# EAGLE board star-tracker-card (EAGLE 9.6.1), part 1 of 3
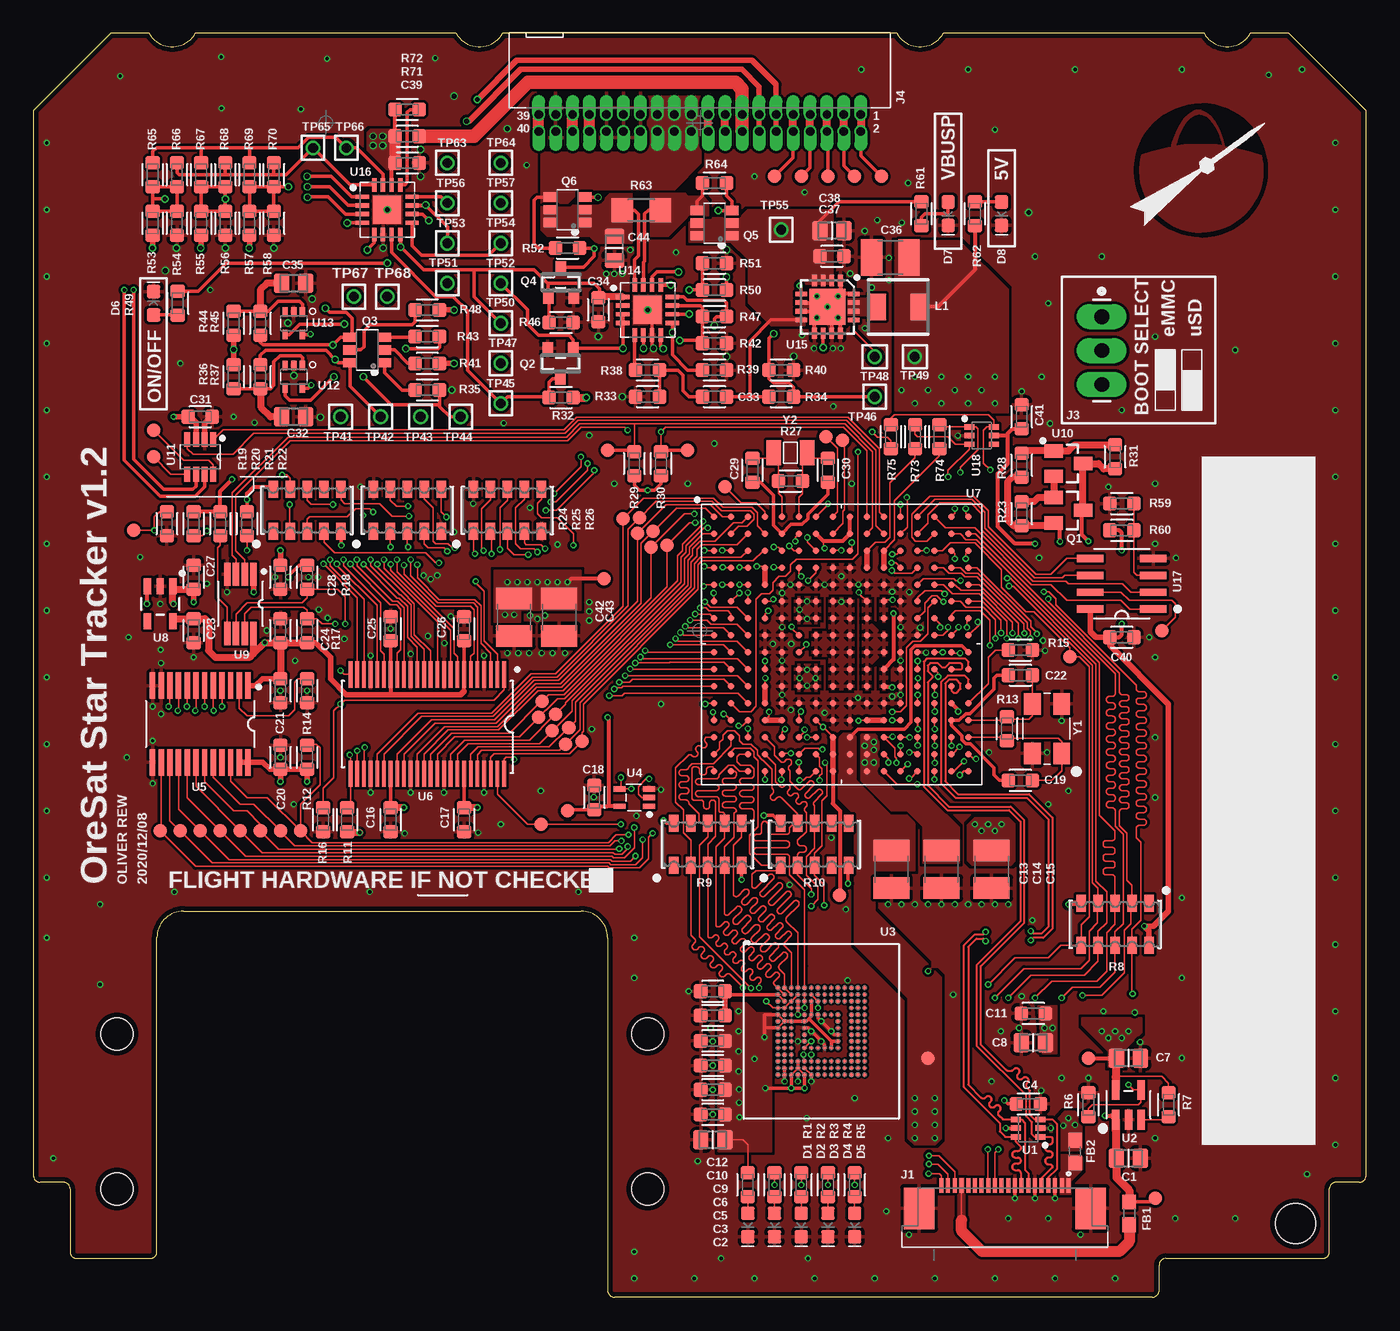
[diagram p9: board, top side]
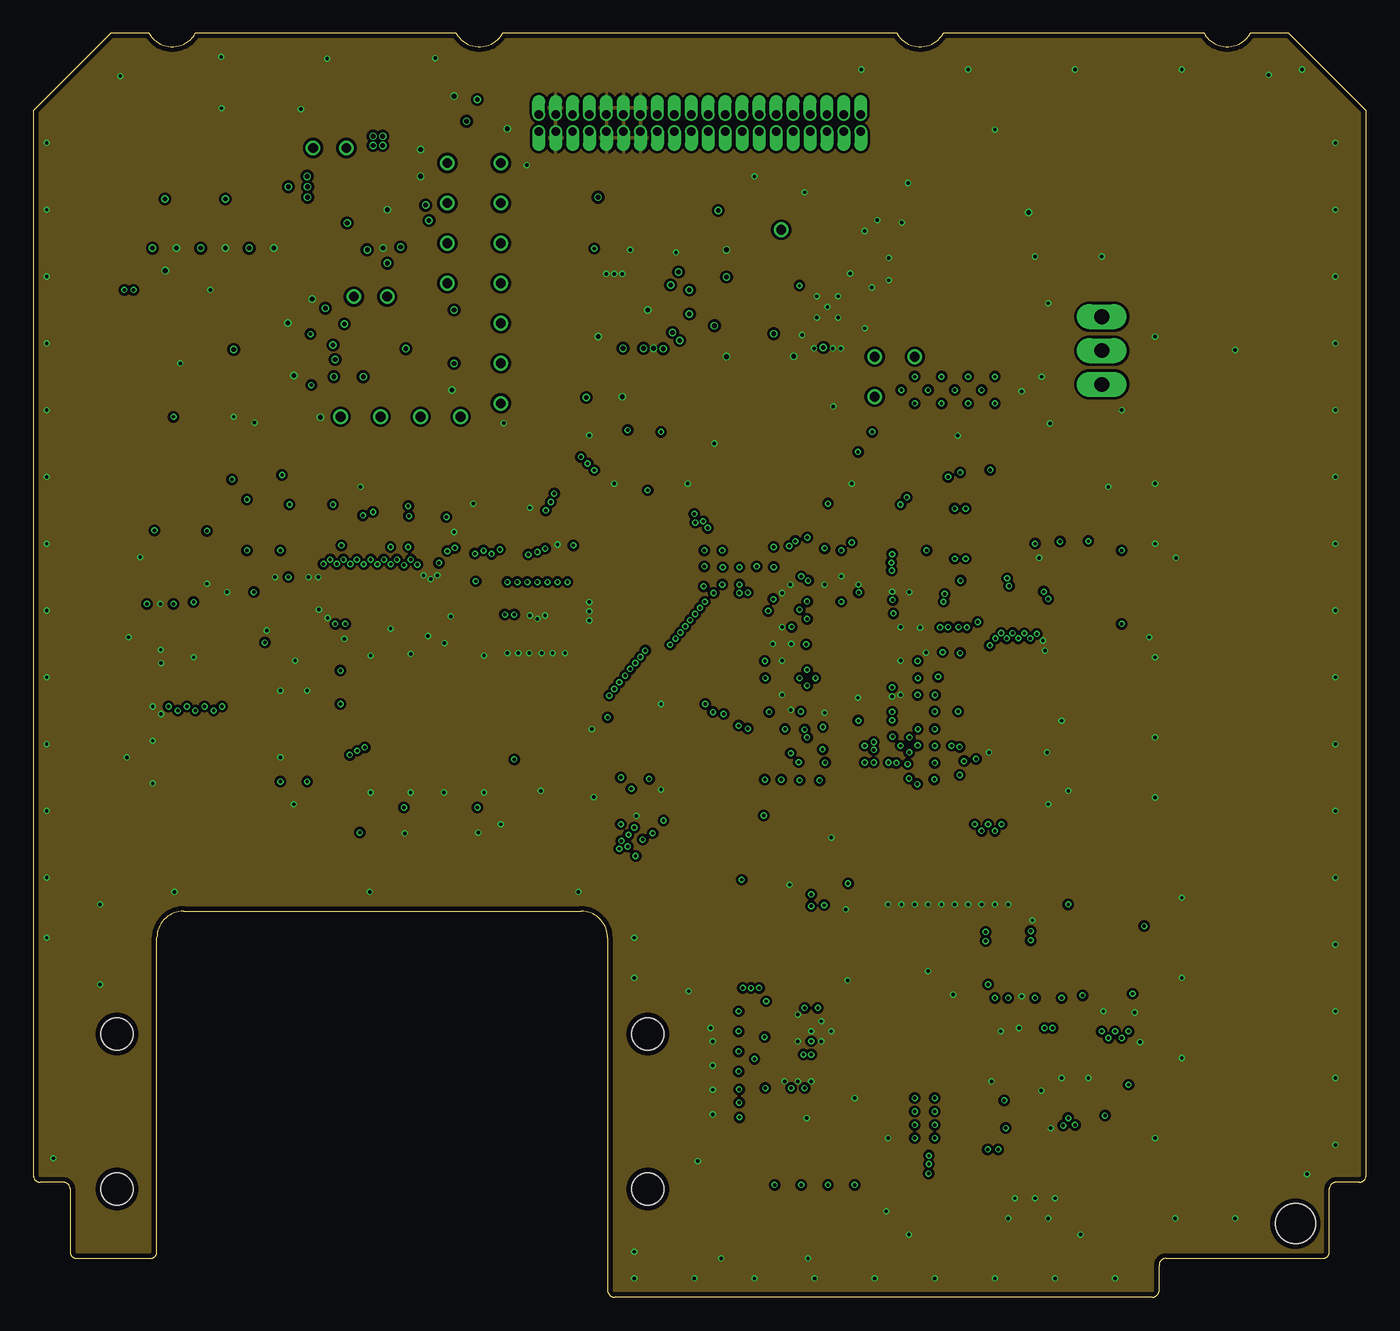
[diagram p10: board, inner layer Route2]
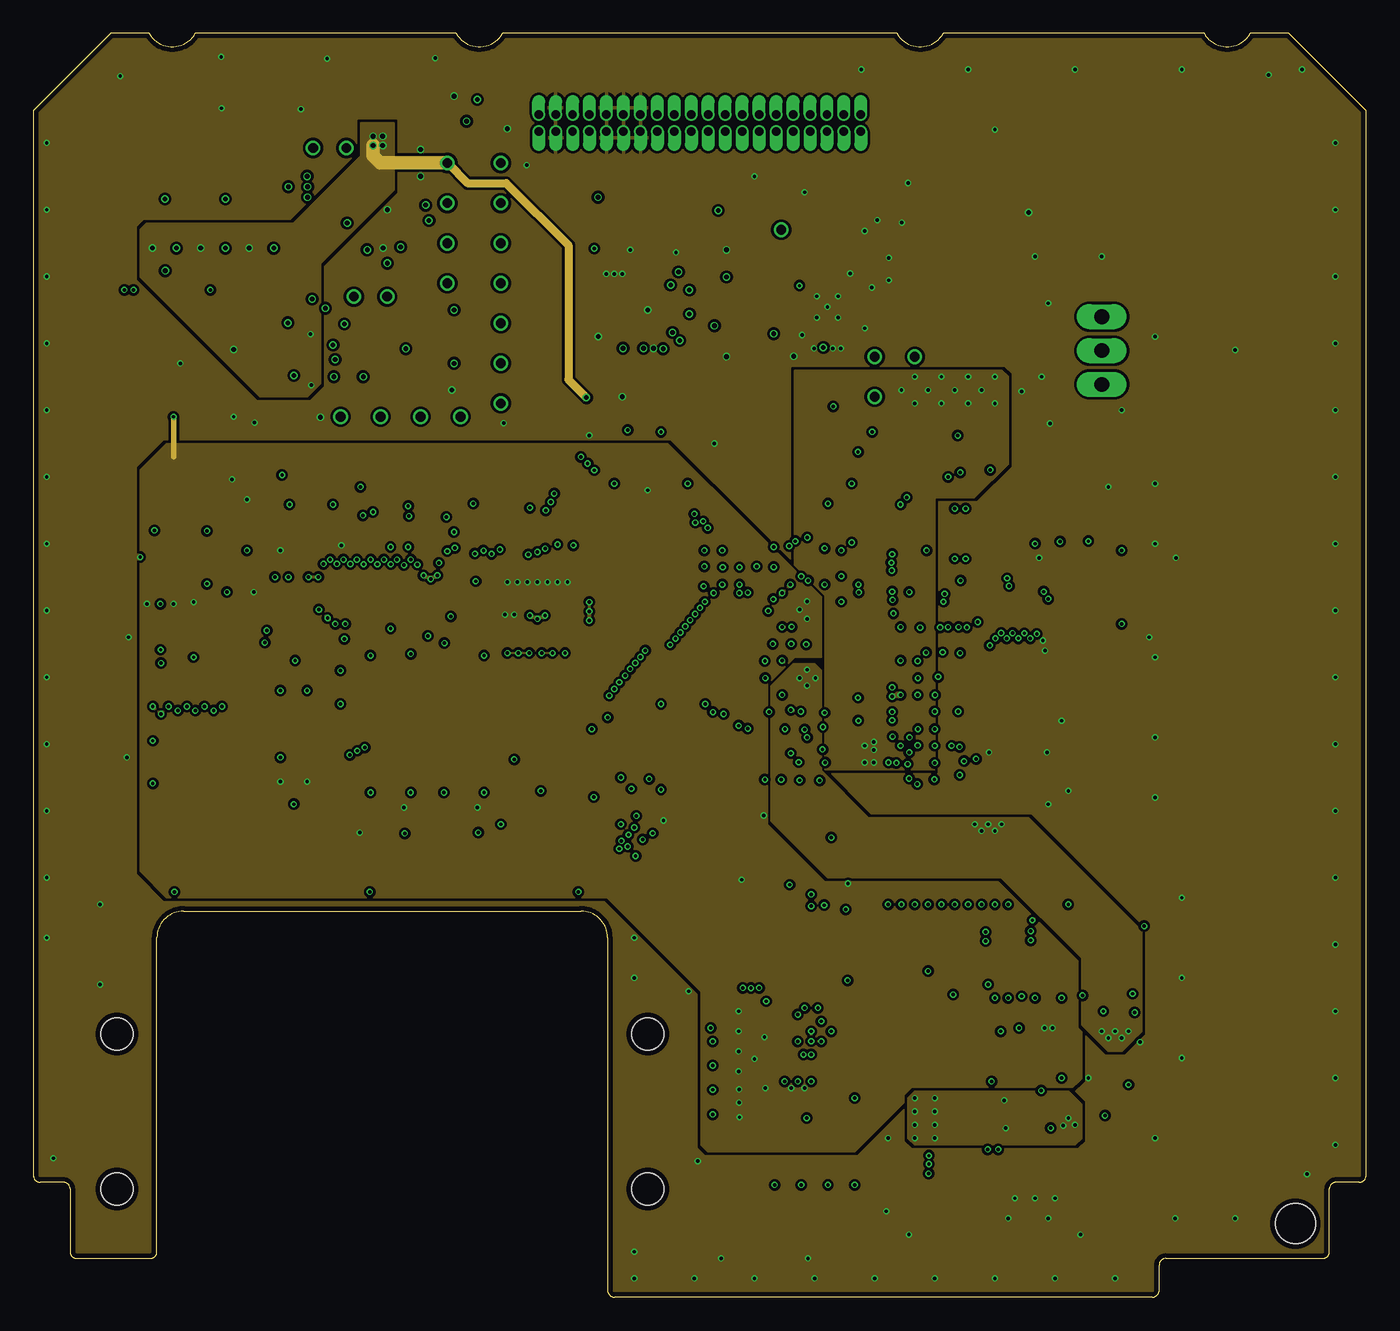
[diagram p11: board, inner layer Route15]
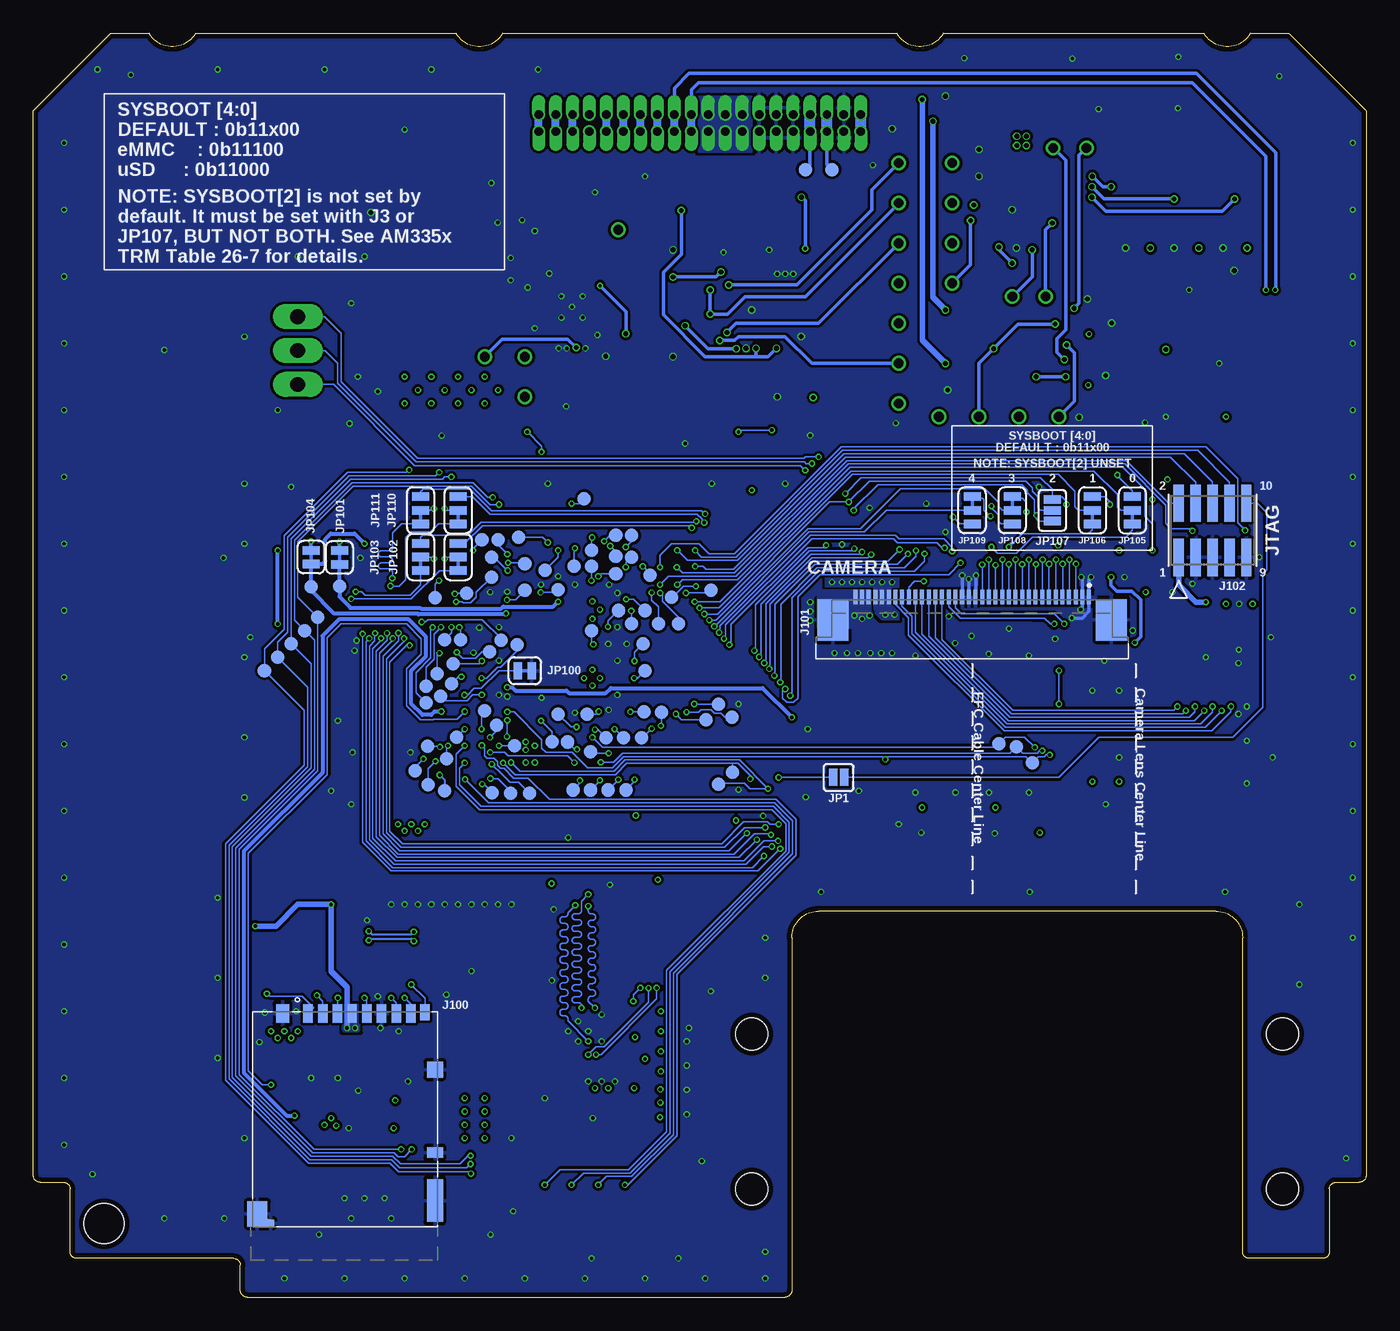
[diagram p12: board, bottom side, seen from below]

Size 99.8 x 94.6 mm. Coordinates in mm from the lower left corner, seen from the top.
Copper layers (1*2*15*16): Top 0.035559375mm / dielectric 0.17018125mm / Route2 0.01778125mm / dielectric 47mil / Route15 0.01778125mm / dielectric 0.17018125mm / Bottom 0.035559375mm
Design rules "4-layer_tented *": minimum track width 5mil, minimum drill 10mil, track to track 5mil, track to pad 5mil, pad to pad 5mil, via to via 5mil, smd to smd 5mil, copper to edge 15mil, drill to drill 6mil, minimum pad ring 4mil, minimum via ring 4mil, stop-mask expansion 2.5mil, vias tented up to drill 20mil, thermal gap 10mil
Net classes: 1 diff pair: width 0.191 mm, clearance 0.191 mm

## Footprints (pad centres in the part's own frame; a part is rotated, then mirrored left to right if it is on the bottom)
.0805-B = smd 1.15 x 1.45: 1 -0.9,0; 2 0.9,0
.0603-A = smd 1 x 1.05: 1 -0.9,0; 2 0.9,0
C1210 = smd 1.6 x 2.7: 1 -1.4,0; 2 1.4,0
.0805-B-NOSILK = smd 1.15 x 1.45: 1 -0.9,0; 2 0.9,0
LED-0603 = smd 1 x 1: A -0.877,0; C 0.877,0
0603 = smd 1.1 x 1: 1 -0.85,0; 2 0.85,0
TE_2-1734592-0 = smd 0.3 x 1.1: 1 -4.75,-1.7; 2 -4.25,-1.7; 3 -3.75,-1.7; 4 -3.25,-1.7; 5 -2.75,-1.7; 6 -2.25,-1.7; 7 -1.75,-1.7; 8 -1.25,-1.7; 9 -0.75,-1.7; 10 -0.25,-1.7; 11 0.25,-1.7; 12 0.75,-1.7; 13 1.25,-1.7; 14 1.75,-1.7; 15 2.25,-1.7; 16 2.75,-1.7; 17 3.25,-1.7; 18 3.75,-1.7; 19 4.25,-1.7; 20 4.75,-1.7 | smd 2.3 x 3.1: PAD1 6.42,0; PAD2 -6.42,0
1X03_LONGPADS = drill 1.118 pad 1.88 long: 1 0,0; 2 2.54,0; 3 5.08,0
J-SAMTEC-TFM-120-X1-XXX-D-RA = drill 0.635 pad 0.965 offset: 1 12.065,0.635; 2 12.065,-0.635; 3 10.795,0.635; 4 10.795,-0.635; 5 9.525,0.635; 6 9.525,-0.635; 7 8.255,0.635; 8 8.255,-0.635; 9 6.985,0.635; 10 6.985,-0.635; 11 5.715,0.635; 12 5.715,-0.635; 13 4.445,0.635; 14 4.445,-0.635; 15 3.175,0.635; 16 3.175,-0.635; 17 1.905,0.635; 18 1.905,-0.635; 19 0.635,0.635; 20 0.635,-0.635; 21 -0.635,0.635; 22 -0.635,-0.635; 23 -1.905,0.635; 24 -1.905,-0.635; 25 -3.175,0.635; 26 -3.175,-0.635; 27 -4.445,0.635; 28 -4.445,-0.635; 29 -5.715,0.635; 30 -5.715,-0.635; 31 -6.985,0.635; 32 -6.985,-0.635; 33 -8.255,0.635; 34 -8.255,-0.635; 35 -9.525,0.635; 36 -9.525,-0.635; 37 -10.795,0.635; 38 -10.795,-0.635; 39 -12.065,0.635; 40 -12.065,-0.635
DM3BT-DSF-PEJS = smd 0.7 x 1.4: 1 -3.2,15.95; 2 -2.1,15.95; 3 -1,15.95; 4 0.1,15.95; 5 1.2,15.95; 6 2.3,15.95; 7 3.4,15.95; 8 4.5,15.95 | smd 0.7 x 1.2: CD 5.55,16.05 | smd 0.5 x 0.5: CGND1 -6,0.25 | smd 1.5 x 1.9: CGND2 -7,0.95 | smd 0.21 x 0.21 rotated 45: CGND3 -6.25,0.5 | smd 1 x 1.4: CGND4 -5.1,15.95 | smd 1.2 x 1.2: CGND5 6.3,11.75 | smd 1.2 x 3.2: CGND6 6.3,1.95 | smd 1.2 x 0.8: GND 6.3,5.55
TE_3-1734592-6 = smd 0.3 x 1.1: 1 -8.75,0; 2 -8.25,0; 3 -7.75,0; 4 -7.25,0; 5 -6.75,0; 6 -6.25,0; 7 -5.75,0; 8 -5.25,0; 9 -4.75,0; 10 -4.25,0; 11 -3.75,0; 12 -3.25,0; 13 -2.75,0; 14 -2.25,0; 15 -1.75,0; 16 -1.25,0; 17 -0.75,0; 18 -0.25,0; 19 0.25,0; 20 0.75,0; 21 1.25,0; 22 1.75,0; 23 2.25,0; 24 2.75,0; 25 3.25,0; 26 3.75,0; 27 4.25,0; 28 4.75,0; 29 5.25,0; 30 5.75,0; 31 6.25,0; 32 6.75,0; 33 7.25,0; 34 7.75,0; 35 8.25,0; 36 8.75,0 | smd 2.3 x 3.1: S1 10.42,1.7; S2 -10.42,1.7
CON10_2X5_DUK_FTSH = smd 0.762 x 2.794: 1 -2.54,-2.032; 2 -2.54,2.032; 3 -1.27,-2.032; 4 -1.27,2.032; 5 0,-2.032; 6 0,2.032; 7 1.27,-2.032; 8 1.27,2.032; 9 2.54,-2.032; 10 2.54,2.032
SMT-JUMPER_2_NO_SILK = smd 0.635 x 1.27: 1 -0.406,0; 2 0.406,0
SMT-JUMPER_2_NC_TRACE_SILK = smd 0.635 x 1.27: 1 -0.508,0; 2 0.508,0
SMT-JUMPER_3_1-NC_TRACE_SILK = smd 0.635 x 1.27: 1 -1.016,0; 2 0,0; 3 1.016,0
SMT-JUMPER_3_NO_SILK = smd 0.635 x 1.27: 1 -0.813,0; 2 0,0; 3 0.813,0
ECS-MPI4040 = smd 2 x 1.3: 1 0,1.575; 2 0,-1.575
ORESAT-CARD-V1.3-STAR-TRACKER = hole 2.4: 46,19.7; 46,8.1; 6.25,19.7; 6.25,8.1 | hole 3: 94.5,5.5
SOT23-BEC = smd 1 x 1.4: B -0.95,-1.1; C 0,1.1; E 0.95,-1.1
SOT23 = smd 0.787 x 0.889: 1 -0.953,-1.143; 2 0.953,-1.143; 3 0,1.143
SOT23-6 = smd 0.7 x 1: 1 -0.95,-1.3; 2 0,-1.3; 3 0.95,-1.3; 4 0.95,1.3; 5 0,1.3; 6 -0.95,1.3
ARRAY_EXBA-M = smd 1.27 x 0.711: 1 -1.575,2.54; 2 -1.575,1.27; 3 -1.575,0; 4 -1.575,-1.27; 5 -1.575,-2.54; 6 1.575,-2.54; 7 1.575,-1.27; 8 1.575,0; 9 1.575,1.27; 10 1.575,2.54
R1206 = smd 1.6 x 1.803: 1 -1.422,0; 2 1.422,0
PAD.03X.04 = smd 1.016 x 1.016: P$1 0,0
2MM-TEST-POINT = drill 0.737: 1 0,0
SC70-6 = smd 0.4 x 0.75: 1 -0.65,-0.925; 2 0,-0.925; 3 0.65,-0.925; 4 0.65,0.925; 5 0,0.925; 6 -0.65,0.925
DBV5 = smd 1.473 x 0.559: 1 -1.118,0.95; 2 -1.118,0; 3 -1.118,-0.95; 4 1.118,-0.95; 5 1.118,0.95
BGA-153(11.5X13)(EMMC-BA) = smd 0.28 x 0.28: A1 -3.25,3.25; A2 -2.75,3.25; A3 -2.25,3.25; A4 -1.75,3.25; A5 -1.25,3.25; A6 -0.75,3.25; A7 -0.25,3.25; A8 0.25,3.25; A9 0.75,3.25; A10 1.25,3.25; A11 1.75,3.25; A12 2.25,3.25; A13 2.75,3.25; A14 3.25,3.25; B1 -3.25,2.75; B2 -2.75,2.75; B3 -2.25,2.75; B4 -1.75,2.75; B5 -1.25,2.75; B6 -0.75,2.75; B7 -0.25,2.75; B8 0.25,2.75; B9 0.75,2.75; B10 1.25,2.75; B11 1.75,2.75; B12 2.25,2.75; B13 2.75,2.75; B14 3.25,2.75; C1 -3.25,2.25; C2 -2.75,2.25; C3 -2.25,2.25; C4 -1.75,2.25; C5 -1.25,2.25; C6 -0.75,2.25; C7 -0.25,2.25; C8 0.25,2.25; C9 0.75,2.25; C10 1.25,2.25; C11 1.75,2.25; C12 2.25,2.25; C13 2.75,2.25; C14 3.25,2.25; D1 -3.25,1.75; D2 -2.75,1.75; D3 -2.25,1.75; D4 -1.75,1.75; D12 2.25,1.75; D13 2.75,1.75; D14 3.25,1.75; E1 -3.25,1.25; E2 -2.75,1.25; E3 -2.25,1.25; E5 -1.25,1.25; E6 -0.75,1.25; E7 -0.25,1.25; E8 0.25,1.25; E9 0.75,1.25; E10 1.25,1.25; E12 2.25,1.25; E13 2.75,1.25; E14 3.25,1.25; F1 -3.25,0.75; F2 -2.75,0.75; F3 -2.25,0.75; F5 -1.25,0.75; F10 1.25,0.75; F12 2.25,0.75; F13 2.75,0.75; F14 3.25,0.75; G1 -3.25,0.25; G2 -2.75,0.25; G3 -2.25,0.25; G5 -1.25,0.25; G10 1.25,0.25; G12 2.25,0.25; G13 2.75,0.25; G14 3.25,0.25; H1 -3.25,-0.25; H2 -2.75,-0.25; H3 -2.25,-0.25; H5 -1.25,-0.25; H10 1.25,-0.25; H12 2.25,-0.25; H13 2.75,-0.25; H14 3.25,-0.25; J1 -3.25,-0.75; J2 -2.75,-0.75; J3 -2.25,-0.75; J5 -1.25,-0.75; J10 1.25,-0.75; J12 2.25,-0.75; J13 2.75,-0.75; J14 3.25,-0.75; K1 -3.25,-1.25; K2 -2.75,-1.25; K3 -2.25,-1.25; K5 -1.25,-1.25; K6 -0.75,-1.25; K7 -0.25,-1.25; K8 0.25,-1.25; K9 0.75,-1.25; K10 1.25,-1.25; K12 2.25,-1.25; K13 2.75,-1.25; K14 3.25,-1.25; L1 -3.25,-1.75; L2 -2.75,-1.75; L3 -2.25,-1.75; L12 2.25,-1.75; L13 2.75,-1.75; L14 3.25,-1.75; M1 -3.25,-2.25; M2 -2.75,-2.25; M3 -2.25,-2.25; M4 -1.75,-2.25; M5 -1.25,-2.25; M6 -0.75,-2.25; M7 -0.25,-2.25; M8 0.25,-2.25; M9 0.75,-2.25; M10 1.25,-2.25; M11 1.75,-2.25; M12 2.25,-2.25; M13 2.75,-2.25; M14 3.25,-2.25; N1 -3.25,-2.75; N2 -2.75,-2.75; N3 -2.25,-2.75; N4 -1.75,-2.75; N5 -1.25,-2.75; N6 -0.75,-2.75; N7 -0.25,-2.75; N8 0.25,-2.75; N9 0.75,-2.75; N10 1.25,-2.75; N11 1.75,-2.75; N12 2.25,-2.75; N13 2.75,-2.75; N14 3.25,-2.75; P1 -3.25,-3.25; P2 -2.75,-3.25; P3 -2.25,-3.25; P4 -1.75,-3.25; P5 -1.25,-3.25; P6 -0.75,-3.25; P7 -0.25,-3.25; P8 0.25,-3.25; P9 0.75,-3.25; P10 1.25,-3.25; P11 1.75,-3.25; P12 2.25,-3.25; P13 2.75,-3.25; P14 3.25,-3.25
C70(TI-DCK) = smd 0.4 x 0.9: 1 0.65,1.1; 2 0,1.1; 3 -0.65,1.1; 4 -0.65,-1.1; 5 0.65,-1.1
PW24-M = smd 1.981 x 0.406: 1 -2.87,3.575; 2 -2.87,2.925; 3 -2.87,2.275; 4 -2.87,1.625; 5 -2.87,0.975; 6 -2.87,0.325; 7 -2.87,-0.325; 8 -2.87,-0.975; 9 -2.87,-1.625; 10 -2.87,-2.275; 11 -2.87,-2.925; 12 -2.87,-3.575; 13 2.87,-3.575; 14 2.87,-2.925; 15 2.87,-2.275; 16 2.87,-1.625; 17 2.87,-0.975; 18 2.87,-0.325; 19 2.87,0.325; 20 2.87,0.975; 21 2.87,1.625; 22 2.87,2.275; 23 2.87,2.925; 24 2.87,3.575
DGG48-M = smd 1.981 x 0.279: 1 -3.721,5.75; 2 -3.721,5.25; 3 -3.721,4.75; 4 -3.721,4.25; 5 -3.721,3.75; 6 -3.721,3.25; 7 -3.721,2.75; 8 -3.721,2.25; 9 -3.721,1.75; 10 -3.721,1.25; 11 -3.721,0.75; 12 -3.721,0.25; 13 -3.721,-0.25; 14 -3.721,-0.75; 15 -3.721,-1.25; 16 -3.721,-1.75; 17 -3.721,-2.25; 18 -3.721,-2.75; 19 -3.721,-3.25; 20 -3.721,-3.75; 21 -3.721,-4.25; 22 -3.721,-4.75; 23 -3.721,-5.25; 24 -3.721,-5.75; 25 3.721,-5.75; 26 3.721,-5.25; 27 3.721,-4.75; 28 3.721,-4.25; 29 3.721,-3.75; 30 3.721,-3.25; 31 3.721,-2.75; 32 3.721,-2.25; 33 3.721,-1.75; 34 3.721,-1.25; 35 3.721,-0.75; 36 3.721,-0.25; 37 3.721,0.25; 38 3.721,0.75; 39 3.721,1.25; 40 3.721,1.75; 41 3.721,2.25; 42 3.721,2.75; 43 3.721,3.25; 44 3.721,3.75; 45 3.721,4.25; 46 3.721,4.75; 47 3.721,5.25; 48 3.721,5.75
OSD335X-BGA-256 = smd 0.5 x 0.5: A1 -9.525,-9.525; A2 -9.525,-8.255; A3 -9.525,-6.985; A4 -9.525,-5.715; A5 -9.525,-4.445; A6 -9.525,-3.175; A7 -9.525,-1.905; A8 -9.525,-0.635; A9 -9.525,0.635; A10 -9.525,1.905; A11 -9.525,3.175; A12 -9.525,4.445; A13 -9.525,5.715; A14 -9.525,6.985; A15 -9.525,8.255; A16 -9.525,9.525; B1 -8.255,-9.525; B2 -8.255,-8.255; B3 -8.255,-6.985; B4 -8.255,-5.715; B5 -8.255,-4.445; B6 -8.255,-3.175; B7 -8.255,-1.905; B8 -8.255,-0.635; B9 -8.255,0.635; B10 -8.255,1.905; B11 -8.255,3.175; B12 -8.255,4.445; B13 -8.255,5.715; B14 -8.255,6.985; B15 -8.255,8.255; B16 -8.255,9.525; C1 -6.985,-9.525; C2 -6.985,-8.255; C3 -6.985,-6.985; C4 -6.985,-5.715; C5 -6.985,-4.445; C6 -6.985,-3.175; C7 -6.985,-1.905; C8 -6.985,-0.635; C9 -6.985,0.635; C10 -6.985,1.905; C11 -6.985,3.175; C12 -6.985,4.445; C13 -6.985,5.715; C14 -6.985,6.985; C15 -6.985,8.255; C16 -6.985,9.525; D1 -5.715,-9.525; D2 -5.715,-8.255; D3 -5.715,-6.985; D4 -5.715,-5.715; D5 -5.715,-4.445; D6 -5.715,-3.175; D7 -5.715,-1.905; D8 -5.715,-0.635; D9 -5.715,0.635; D10 -5.715,1.905; D11 -5.715,3.175; D12 -5.715,4.445; D13 -5.715,5.715; D14 -5.715,6.985; D15 -5.715,8.255; D16 -5.715,9.525; E1 -4.445,-9.525; E2 -4.445,-8.255; E3 -4.445,-6.985; E4 -4.445,-5.715; E5 -4.445,-4.445; E6 -4.445,-3.175; E7 -4.445,-1.905; E8 -4.445,-0.635; E9 -4.445,0.635; E10 -4.445,1.905; E11 -4.445,3.175; E12 -4.445,4.445; E13 -4.445,5.715; E14 -4.445,6.985; E15 -4.445,8.255; E16 -4.445,9.525; F1 -3.175,-9.525; F2 -3.175,-8.255; F3 -3.175,-6.985; F4 -3.175,-5.715; F5 -3.175,-4.445; F6 -3.175,-3.175; F7 -3.175,-1.905; F8 -3.175,-0.635; F9 -3.175,0.635; F10 -3.175,1.905; F11 -3.175,3.175; F12 -3.175,4.445; F13 -3.175,5.715; F14 -3.175,6.985; F15 -3.175,8.255; F16 -3.175,9.525; G1 -1.905,-9.525; G2 -1.905,-8.255; G3 -1.905,-6.985; G4 -1.905,-5.715; G5 -1.905,-4.445; G6 -1.905,-3.175; G7 -1.905,-1.905; G8 -1.905,-0.635; G9 -1.905,0.635; G10 -1.905,1.905; G11 -1.905,3.175; G12 -1.905,4.445; G13 -1.905,5.715; G14 -1.905,6.985; G15 -1.905,8.255; G16 -1.905,9.525; H1 -0.635,-9.525; H2 -0.635,-8.255; H3 -0.635,-6.985; H4 -0.635,-5.715; H5 -0.635,-4.445; H6 -0.635,-3.175; H7 -0.635,-1.905; H8 -0.635,-0.635; H9 -0.635,0.635; H10 -0.635,1.905; H11 -0.635,3.175; H12 -0.635,4.445; H13 -0.635,5.715; H14 -0.635,6.985; H15 -0.635,8.255; H16 -0.635,9.525; J1 0.635,-9.525; J2 0.635,-8.255; J3 0.635,-6.985; J4 0.635,-5.715; J5 0.635,-4.445; J6 0.635,-3.175; J7 0.635,-1.905; J8 0.635,-0.635; J9 0.635,0.635; J10 0.635,1.905; J11 0.635,3.175; J12 0.635,4.445; J13 0.635,5.715; J14 0.635,6.985; J15 0.635,8.255; J16 0.635,9.525; K1 1.905,-9.525; K2 1.905,-8.255; K3 1.905,-6.985; K4 1.905,-5.715; K5 1.905,-4.445; K6 1.905,-3.175; K7 1.905,-1.905; K8 1.905,-0.635; K9 1.905,0.635; K10 1.905,1.905; K11 1.905,3.175; K12 1.905,4.445; K13 1.905,5.715; K14 1.905,6.985; K15 1.905,8.255; K16 1.905,9.525; L1 3.175,-9.525; L2 3.175,-8.255; L3 3.175,-6.985; L4 3.175,-5.715; L5 3.175,-4.445; L6 3.175,-3.175; L7 3.175,-1.905; L8 3.175,-0.635; L9 3.175,0.635; L10 3.175,1.905; L11 3.175,3.175; L12 3.175,4.445; L13 3.175,5.715; L14 3.175,6.985; L15 3.175,8.255; L16 3.175,9.525; M1 4.445,-9.525; M2 4.445,-8.255; M3 4.445,-6.985; M4 4.445,-5.715; M5 4.445,-4.445; M6 4.445,-3.175; M7 4.445,-1.905; M8 4.445,-0.635; M9 4.445,0.635; M10 4.445,1.905; M11 4.445,3.175; M12 4.445,4.445; M13 4.445,5.715; M14 4.445,6.985; M15 4.445,8.255; M16 4.445,9.525; N1 5.715,-9.525; N2 5.715,-8.255; N3 5.715,-6.985; N4 5.715,-5.715; N5 5.715,-4.445; N6 5.715,-3.175; N7 5.715,-1.905; N8 5.715,-0.635; N9 5.715,0.635; N10 5.715,1.905; N11 5.715,3.175; N12 5.715,4.445; N13 5.715,5.715; N14 5.715,6.985; N15 5.715,8.255; N16 5.715,9.525; P1 6.985,-9.525; P2 6.985,-8.255; P3 6.985,-6.985; P4 6.985,-5.715; P5 6.985,-4.445; P6 6.985,-3.175; P7 6.985,-1.905; P8 6.985,-0.635; P9 6.985,0.635; P10 6.985,1.905; P11 6.985,3.175; P12 6.985,4.445; P13 6.985,5.715; P14 6.985,6.985; P15 6.985,8.255; P16 6.985,9.525; R1 8.255,-9.525; R2 8.255,-8.255; R3 8.255,-6.985; R4 8.255,-5.715; R5 8.255,-4.445; R6 8.255,-3.175; R7 8.255,-1.905; R8 8.255,-0.635; R9 8.255,0.635; R10 8.255,1.905; R11 8.255,3.175; R12 8.255,4.445; R13 8.255,5.715; R14 8.255,6.985; R15 8.255,8.255; R16 8.255,9.525; T1 9.525,-9.525; T2 9.525,-8.255; T3 9.525,-6.985; T4 9.525,-5.715; T5 9.525,-4.445; T6 9.525,-3.175; T7 9.525,-1.905; T8 9.525,-0.635; T9 9.525,0.635; T10 9.525,1.905; T11 9.525,3.175; T12 9.525,4.445; T13 9.525,5.715; T14 9.525,6.985; T15 9.525,8.255; T16 9.525,9.525
SOT23-5 = smd 0.55 x 1.2: 1 -0.95,-1.3; 2 0,-1.3; 3 0.95,-1.3; 4 0.95,1.3; 5 -0.95,1.3
DGK8-M = smd 1.727 x 0.483: 1 -2.223,0.975; 2 -2.223,0.325; 3 -2.223,-0.325; 4 -2.223,-0.975; 5 2.223,-0.975; 6 2.223,-0.325; 7 2.223,0.325; 8 2.223,0.975
SOT23-3 = smd 1 x 1.4: 1 -0.95,-1.1; 2 0.95,-1.1; 3 0,1.1
SOT23-8_TI-DCN = smd 0.45 x 1.1: 1 -0.975,-1.3; 2 -0.325,-1.3; 3 0.325,-1.3; 4 0.975,-1.3; 5 0.975,1.3; 6 0.325,1.3; 7 -0.325,1.3; 8 -0.975,1.3
SC70-5 = smd 0.4 x 0.7: 1 -0.65,-0.85; 2 0,-0.85; 3 0.65,-0.85; 4 0.65,0.85; 5 -0.65,0.85
QFN65P400X400X80-17T210 = smd 1.01 x 0.32: 1 -1.86,0.975; 2 -1.86,0.325; 3 -1.86,-0.325; 4 -1.86,-0.975; 9 1.86,-0.975; 10 1.86,-0.325; 11 1.86,0.325; 12 1.86,0.975 | smd 0.32 x 1.01: 5 -0.975,-1.86; 6 -0.325,-1.86; 7 0.325,-1.86; 8 0.975,-1.86; 13 0.975,1.86; 14 0.325,1.86; 15 -0.325,1.86; 16 -0.975,1.86 | smd 2.1 x 2.1: EPAD 0,0
S-PVQFN-16 = smd 0.85 x 0.35: 1 -1.975,0.975; 2 -1.975,0.325; 3 -1.975,-0.325; 4 -1.975,-0.975; 9 1.975,-0.975; 10 1.975,-0.325; 11 1.975,0.325; 12 1.975,0.975 | smd 0.35 x 0.85: 5 -0.975,-1.975; 6 -0.325,-1.975; 7 0.325,-1.975; 8 0.975,-1.975; 13 0.975,1.975; 14 0.325,1.975; 15 -0.325,1.975; 16 -0.975,1.975 | smd 2.7 x 2.7: PAD 0,0
SOIC8 = smd 1.981 x 0.559: 1 -2.362,1.905; 2 -2.362,0.635; 3 -2.362,-0.635; 4 -2.362,-1.905; 5 2.362,-1.905; 6 2.362,-0.635; 7 2.362,0.635; 8 2.362,1.905
5X3.2-4SMD = smd 1.6 x 1.25: 1 -1.85,-1.1; 2 1.85,-1.1; 3 1.85,1.1; 4 -1.85,1.1
CRYSTAL_3.2X1.5 = smd 1.1 x 1.9: P$1 -1.25,0; P$2 1.25,0

## Placement (x,y rotation side)
C1  10uF  [.0805-B]  82,10.4 0 top
C2  10uF  [.0805-B]  50.88,11.78 180 top
C3  1uF  [.0603-A]  50.88,13.68 180 top
C4  0.1uF  [.0603-A]  74.5,14.46 0 top
C5  1uF  [.0603-A]  50.88,15.53 180 top
C6  1uF  [.0603-A]  50.88,17.34 180 top
C7  10uF  [.0805-B]  82,17.9 0 top
C8  10uF  [.0805-B]  74.88,19.06 180 top
C9  1uF  [.0603-A]  50.88,19.18 180 top
C10  1uF  [.0603-A]  50.88,21.09 180 top
C11  0.1uF  [.0603-A]  74.88,21.24 180 top
C12  1uF  [.0603-A]  50.88,22.9 180 top
C13  22uF  [C1210]  64.25,32.02 270 top
C14  22uF  [C1210]  68,32.02 270 top
C15  22uF  [C1210]  71.75,32.02 270 top
C16  0.1uF  [.0603-A]  26.75,35.74 270 top
C17  0.1uF  [.0603-A]  32.25,35.74 270 top
C18  0.1uF  [.0603-A]  42,37.4 90 top
C19  18pF, 50V  [.0603-A]  73.91,38.68 0 top
C20  0.1uF  [.0603-A]  18.5,40.4 90 top
C21  0.1uF  [.0603-A]  18.5,45.4 270 top
C22  18pF, 50V  [.0603-A]  73.91,46.56 0 top
C23  1uF  [.0603-A]  12,49.9 270 top
C24  0.1uF  [.0603-A]  18.5,49.9 90 top
C25  0.1uF  [.0603-A]  26.75,50.02 90 top
C26  0.1uF  [.0603-A]  32.25,50.02 90 top
C27  1uF  [.0603-A]  12,53.9 90 top
C28  0.1uF  [.0603-A]  18.5,53.9 270 top
C29  18pF, 50V  [.0603-A]  53.84,61.9 270 top
C30  18pF, 50V  [.0603-A]  59.5,61.9 270 top
C31  0.1uF  [.0603-A]  12.5,65.9 180 top
C32  1uF  [.0805-B-NOSILK]  19.5,65.9 0 top
C33  1uF  [.0603-A]  51,67.4 0 top
C34  1uF  [.0603-A]  42.31,73.9 270 top
C35  1uF  [.0805-B-NOSILK]  19.5,75.9 0 top
C36  22uF  [C1210]  64.16,77.83 180 top
C37  1uF  [.0603-A]  59.8,77.91 0 top
C38  10uF  [.0805-B]  59.79,79.84 0 top
C39  0.1uF  [.0603-A]  28,84.9 180 top
C40  0.1uF  [.0603-A]  81.5,49.4 180 top
C41  0.1uF  [.0603-A]  74,65.9 90 top
C42  22uF  [C1210]  36,50.9 270 top
C43  22uF  [C1210]  39.38,50.9 270 top
C44  10uF  [.0805-B]  43.5,78.5 270 top
D1  GREEN  [LED-0603]  53.5,5.4 270 top
D2  BLUE  [LED-0603]  55.5,5.4 270 top
D3  BLUE  [LED-0603]  57.5,5.4 270 top
D4  BLUE  [LED-0603]  59.5,5.4 270 top
D5  BLUE  [LED-0603]  61.5,5.4 270 top
D6  AMBER  [LED-0603]  9,74.4 90 top
D7  GREEN  [LED-0603]  68.5,81.1 270 top
D8  GREEN  [LED-0603]  72.5,81.1 270 top
FB1  30Ω/1.8A  [0603]  82.06,6.28 270 top
FB2  30Ω/1.8A  [0603]  78,10.9 90 top
J1  ORESAT-DEBUG-CONNECTOR-CARD  [TE_2-1734592-0]  72.75,6.65 180 top
J3  [1X03_LONGPADS]  80,73.4 270 top
J4  TFM-120-01-L-D-RA  [J-SAMTEC-TFM-120-X1-XXX-D-RA]  49.9,87.9 0 top
J100  DM3BT-DSF-PEJS  [DM3BT-DSF-PEJS]  76.03,5.28 0 bottom
J101  3-1734592-64-1734592-0  [TE_3-1734592-6]  29.5,52.4 180 bottom
J102  FTSH-105-XX-X-DV-K  [CON10_2X5_DUK_FTSH]  11.5,57.4 0 bottom
JP1  JUMPER-SMT_2_NO_SILK  [SMT-JUMPER_2_NO_SILK]  39.5,38.9 0 bottom
JP100  JUMPER-SMT_2_NC_TRACE_SILK  [SMT-JUMPER_2_NC_TRACE_SILK]  63,46.9 0 bottom
JP101  JUMPER-SMT_2_NC_TRACE_SILK  [SMT-JUMPER_2_NC_TRACE_SILK]  76.88,55.37 90 bottom
JP102  JUMPER-SMT_3_1-NC_TRACE_SILK  [SMT-JUMPER_3_1-NC_TRACE_SILK]  68,55.4 270 bottom
JP103  JUMPER-SMT_3_1-NC_TRACE_SILK  [SMT-JUMPER_3_1-NC_TRACE_SILK]  70.81,55.4 270 bottom
JP104  JUMPER-SMT_2_NC_TRACE_SILK  [SMT-JUMPER_2_NC_TRACE_SILK]  79,55.4 90 bottom
JP105  JUMPER-SMT_3_1-NC_TRACE_SILK  [SMT-JUMPER_3_1-NC_TRACE_SILK]  17.5,58.9 270 bottom
JP106  JUMPER-SMT_3_1-NC_TRACE_SILK  [SMT-JUMPER_3_1-NC_TRACE_SILK]  20.5,58.9 270 bottom
JP107  JUMPER-SMT_3_NO_SILK  [SMT-JUMPER_3_NO_SILK]  23.5,58.9 270 bottom
JP108  JUMPER-SMT_3_1-NC_TRACE_SILK  [SMT-JUMPER_3_1-NC_TRACE_SILK]  26.5,58.9 90 bottom
JP109  JUMPER-SMT_3_1-NC_TRACE_SILK  [SMT-JUMPER_3_1-NC_TRACE_SILK]  29.5,58.9 90 bottom
JP110  JUMPER-SMT_3_1-NC_TRACE_SILK  [SMT-JUMPER_3_1-NC_TRACE_SILK]  68,58.9 270 bottom
JP111  JUMPER-SMT_3_1-NC_TRACE_SILK  [SMT-JUMPER_3_1-NC_TRACE_SILK]  70.81,58.9 270 bottom
L1  6.8u  [ECS-MPI4040]  64.76,74.12 90 top
PCB1  ORESAT-CARD-V1.3-STAR-TRACKER  [ORESAT-CARD-V1.3-STAR-TRACKER]  0,0 0 top
Q1  MMBT2907  [SOT23-BEC]  77.5,58.9 270 top
Q2  PMV45EN  [SOT23]  39.47,69.9 180 top
Q3  DMP2240UDM  [SOT23-6]  25,70.9 90 top
Q4  PMV45EN  [SOT23]  39.5,75.96 0 top
Q5  MOSFET-PCH-SOT23-6  [SOT23-6]  51,80.4 90 top
Q6  MOSFET-PCH-SOT23-6  [SOT23-6]  40,81.4 90 top
R1  1k  [.0603-A]  53.5,8.4 270 top
R2  1k  [.0603-A]  55.5,8.4 270 top
R3  1k  [.0603-A]  57.5,8.4 270 top
R4  1k  [.0603-A]  59.5,8.4 270 top
R5  1k  [.0603-A]  61.5,8.4 270 top
R6  10k  [.0603-A]  79,14.4 270 top
R7  10k  [.0603-A]  85,14.4 90 top
R8  10K  [ARRAY_EXBA-M]  81,27.9 270 top
R9  10K  [ARRAY_EXBA-M]  50.5,33.9 90 top
R10  10K  [ARRAY_EXBA-M]  58.5,33.9 90 top
R11  10k  [.0603-A]  23.5,35.74 270 top
R12  10k  [.0603-A]  20.5,40.4 270 top
R13  1M  [.0603-A]  72.91,42.56 270 top
R14  10k  [.0603-A]  20.5,45.4 270 top
R15  10k  [.0603-A]  73.91,48.43 180 top
R16  10k  [.0603-A]  21.69,35.74 270 top
R17  4.7k  [.0603-A]  20.5,49.9 90 top
R18  4.7k  [.0603-A]  20.5,53.9 270 top
R19  10k  [.0603-A]  10,57.9 90 top
R20  10k  [.0603-A]  12,57.9 90 top
R21  10k  [.0603-A]  14,57.9 90 top
R22  10k  [.0603-A]  16,57.9 90 top
R23  499  [.0603-A]  74,58.65 270 top
R24  100K  [ARRAY_EXBA-M]  20.5,58.9 90 top
R25  100K  [ARRAY_EXBA-M]  28,58.9 90 top
R26  100K  [ARRAY_EXBA-M]  35.5,58.9 90 top
R27  DNP  [.0603-A]  56.69,61.09 0 top
R28  10k  [.0603-A]  74,62.27 270 top
R29  4.7k  [.0603-A]  45,62.4 90 top
R30  4.7k  [.0603-A]  47,62.4 90 top
R31  40.2K  [.0603-A]  81,62.9 90 top
R32  10k  [.0603-A]  39.5,67.34 0 top
R33  100k  [.0603-A]  46,67.4 0 top
R34  10k  [.0603-A]  56,67.4 180 top
R35  665k  [.0603-A]  29.5,67.9 180 top
R36  1M  [.0603-A]  15,68.9 90 top
R37  330k  [.0603-A]  17,68.9 90 top
R38  10k  [.0603-A]  46,69.4 0 top
R39  10k  [.0603-A]  51,69.4 180 top
R40  NP  [.0603-A]  56,69.4 180 top
R41  100  [.0603-A]  29.5,69.9 180 top
R42  NP  [.0603-A]  51,71.4 180 top
R43  665k  [.0603-A]  29.5,71.9 180 top
R44  1M  [.0603-A]  15,72.9 270 top
R45  330k  [.0603-A]  17,72.9 270 top
R46  10k  [.0603-A]  39.5,72.96 180 top
R47  0  [.0603-A]  51,73.4 0 top
R48  100  [.0603-A]  29.5,73.9 180 top
R49  2.7k  [.0603-A]  10.81,74.4 90 top
R50  0  [.0603-A]  51,75.4 0 top
R51  NP  [.0603-A]  51,77.4 180 top
R52  10k  [.0603-A]  40,78.53 180 top
R53  NP  [.0603-A]  8.94,80.4 270 top
R54  NP  [.0603-A]  10.75,80.4 90 top
R55  NP  [.0603-A]  12.56,80.4 270 top
R56  NP  [.0603-A]  14.38,80.4 90 top
R57  NP  [.0603-A]  16.19,80.4 270 top
R58  NP  [.0603-A]  18,80.4 90 top
R59  DNP  [.0603-A]  81.5,59.4 180 top
R60  DNP  [.0603-A]  81.5,57.4 0 top
R61  2.7k  [.0603-A]  66.5,81.1 90 top
R62  2.7k  [.0603-A]  70.5,81.1 270 top
R63  100m  [R1206]  45.53,81.37 0 top
R64  10k  [.0603-A]  51,83.4 180 top
R65  NP  [.0603-A]  8.94,84.03 270 top
R66  NP  [.0603-A]  10.75,84.03 90 top
R67  NP  [.0603-A]  12.56,84.03 270 top
R68  NP  [.0603-A]  14.38,84.03 90 top
R69  NP  [.0603-A]  16.19,84.03 270 top
R70  NP  [.0603-A]  18,84.03 90 top
R71  100  [.0603-A]  28,86.9 180 top
R72  10k  [.0603-A]  28,88.9 180 top
R73  100  [.0603-A]  66.03,64.4 270 top
R74  100  [.0603-A]  67.84,64.4 270 top
R75  100  [.0603-A]  64.22,64.4 270 top
TP1  TEST-POINT3X4  [PAD.03X.04]  84,7.4 0 top
TP2  TEST-POINT3X4  [PAD.03X.04]  67,17.9 90 top
TP3  TEST-POINT3X4  [PAD.03X.04]  79,17.9 90 top
TP4  TEST-POINT3X4  [PAD.03X.04]  60.34,30.09 90 top
TP5  TEST-POINT3X4  [PAD.03X.04]  9.5,34.9 0 top
TP6  TEST-POINT3X4  [PAD.03X.04]  11,34.9 0 top
TP7  TEST-POINT3X4  [PAD.03X.04]  12.5,34.9 0 top
TP8  TEST-POINT3X4  [PAD.03X.04]  14,34.9 0 top
TP9  TEST-POINT3X4  [PAD.03X.04]  15.5,34.9 0 top
TP10  TEST-POINT3X4  [PAD.03X.04]  17,34.9 0 top
TP11  TEST-POINT3X4  [PAD.03X.04]  18.5,34.9 0 top
TP12  TEST-POINT3X4  [PAD.03X.04]  20,34.9 0 top
TP13  TEST-POINT3X4  [PAD.03X.04]  38,35.4 0 top
TP14  TEST-POINT3X4  [PAD.03X.04]  40,36.4 90 top
TP15  TEST-POINT3X4  [PAD.03X.04]  39.84,41.4 0 top
TP16  TEST-POINT3X4  [PAD.03X.04]  41.09,41.62 0 top
TP17  TEST-POINT3X4  [PAD.03X.04]  38.84,42.4 0 top
TP18  TEST-POINT3X4  [PAD.03X.04]  40.09,42.62 0 top
TP19  TEST-POINT3X4  [PAD.03X.04]  37.84,43.4 0 top
TP20  TEST-POINT3X4  [PAD.03X.04]  39.09,43.62 0 top
TP21  TEST-POINT3X4  [PAD.03X.04]  38.09,44.62 0 top
TP22  TEST-POINT3X4  [PAD.03X.04]  77.62,47.93 0 top
TP23  TEST-POINT3X4  [PAD.03X.04]  46.25,56.15 0 top
TP24  TEST-POINT3X4  [PAD.03X.04]  47.45,56.29 0 top
TP25  TEST-POINT3X4  [PAD.03X.04]  42.72,53.77 0 top
TP26  TEST-POINT3X4  [PAD.03X.04]  45.23,57.17 0 top
TP27  TEST-POINT3X4  [PAD.03X.04]  46.41,57.34 0 top
TP28  TEST-POINT3X4  [PAD.03X.04]  44.14,58.26 0 top
TP29  TEST-POINT3X4  [PAD.03X.04]  45.39,58.35 0 top
TP30  TEST-POINT3X4  [PAD.03X.04]  51.78,60.68 0 top
TP31  TEST-POINT3X4  [PAD.03X.04]  7.5,57.4 0 top
TP35  TEST-POINT3X4  [PAD.03X.04]  9,62.9 0 top
TP36  TEST-POINT3X4  [PAD.03X.04]  43,63.4 0 top
TP37  TEST-POINT3X4  [PAD.03X.04]  49,63.4 270 top
TP38  TEST-POINT3X4  [PAD.03X.04]  60.59,64.15 0 top
TP39  TEST-POINT3X4  [PAD.03X.04]  59.34,64.4 0 top
TP40  TEST-POINT3X4  [PAD.03X.04]  9,64.9 0 top
TP41  TEST-POINT  [2MM-TEST-POINT]  23,65.9 0 top
TP42  TEST-POINT  [2MM-TEST-POINT]  26,65.9 0 top
TP43  TEST-POINT  [2MM-TEST-POINT]  29,65.9 0 top
TP44  TEST-POINT  [2MM-TEST-POINT]  32,65.9 0 top
TP45  TEST-POINT  [2MM-TEST-POINT]  35,66.9 0 top
TP46  TEST-POINT  [2MM-TEST-POINT]  63,67.4 0 top
TP47  TEST-POINT  [2MM-TEST-POINT]  35,69.9 0 top
TP48  TEST-POINT  [2MM-TEST-POINT]  63,70.4 270 top
TP49  TEST-POINT  [2MM-TEST-POINT]  66,70.4 270 top
TP50  TEST-POINT  [2MM-TEST-POINT]  35,72.9 0 top
TP51  TEST-POINT  [2MM-TEST-POINT]  31,75.9 0 top
TP52  TEST-POINT  [2MM-TEST-POINT]  35,75.9 0 top
TP53  TEST-POINT  [2MM-TEST-POINT]  31,78.9 0 top
TP54  TEST-POINT  [2MM-TEST-POINT]  35,78.9 0 top
TP55  TEST-POINT  [2MM-TEST-POINT]  56,79.9 0 top
TP56  TEST-POINT  [2MM-TEST-POINT]  31,81.9 0 top
TP57  TEST-POINT  [2MM-TEST-POINT]  35,81.9 0 top
TP58  TEST-POINT3X4  [PAD.03X.04]  55.5,83.9 270 top
TP59  TEST-POINT3X4  [PAD.03X.04]  57.5,83.9 270 top
TP60  TEST-POINT3X4  [PAD.03X.04]  59.5,83.9 270 top
TP61  TEST-POINT3X4  [PAD.03X.04]  61.5,83.9 270 top
TP62  TEST-POINT3X4  [PAD.03X.04]  63.5,83.9 270 top
TP63  TEST-POINT  [2MM-TEST-POINT]  31,84.9 0 top
TP64  TEST-POINT  [2MM-TEST-POINT]  35,84.9 0 top
TP65  TEST-POINT  [2MM-TEST-POINT]  20.94,86.03 0 top
TP66  TEST-POINT  [2MM-TEST-POINT]  23.44,86.03 0 top
TP67  TEST-POINT  [2MM-TEST-POINT]  24,74.9 0 top
TP68  TEST-POINT  [2MM-TEST-POINT]  26.5,74.9 0 top
TP69  TEST-POINT3X4  [PAD.03X.04]  84.5,49.9 0 top
TP100  TEST-POINT3X4  [PAD.03X.04]  62.66,37.71 0 bottom
TP101  TEST-POINT3X4  [PAD.03X.04]  64.06,37.71 0 bottom
TP102  TEST-POINT3X4  [PAD.03X.04]  65.44,37.77 0 bottom
TP103  TEST-POINT3X4  [PAD.03X.04]  69,37.9 0 bottom
TP104  TEST-POINT3X4  [PAD.03X.04]  55.44,37.96 0 bottom
TP105  TEST-POINT3X4  [PAD.03X.04]  56.75,37.96 0 bottom
TP106  TEST-POINT3X4  [PAD.03X.04]  58.06,37.96 0 bottom
TP107  TEST-POINT3X4  [PAD.03X.04]  59.41,37.96 0 bottom
TP108  TEST-POINT3X4  [PAD.03X.04]  70.25,38.37 0 bottom
TP109  TEST-POINT3X4  [PAD.03X.04]  48.5,38.4 0 bottom
TP110  TEST-POINT3X4  [PAD.03X.04]  47.44,39.27 0 bottom
TP111  TEST-POINT3X4  [PAD.03X.04]  71.22,39.4 0 bottom
TP112  TEST-POINT3X4  [PAD.03X.04]  82.5,46.9 270 bottom
TP113  TEST-POINT3X4  [PAD.03X.04]  25,39.99 0 bottom
TP114  TEST-POINT3X4  [PAD.03X.04]  68.84,40.31 0 bottom
TP115  TEST-POINT3X4  [PAD.03X.04]  58.09,40.84 0 bottom
TP116  TEST-POINT3X4  [PAD.03X.04]  26.19,41.21 0 bottom
TP117  TEST-POINT3X4  [PAD.03X.04]  70.28,41.24 0 bottom
TP118  TEST-POINT3X4  [PAD.03X.04]  63.78,41.27 0 bottom
TP119  TEST-POINT3X4  [PAD.03X.04]  27.5,41.43 0 bottom
TP120  TEST-POINT3X4  [PAD.03X.04]  59.81,41.56 0 bottom
TP121  TEST-POINT3X4  [PAD.03X.04]  60.97,41.59 90 bottom
TP122  TEST-POINT3X4  [PAD.03X.04]  54.25,41.87 0 bottom
TP123  TEST-POINT3X4  [PAD.03X.04]  55.59,41.87 0 bottom
TP124  TEST-POINT3X4  [PAD.03X.04]  56.91,41.87 0 bottom
TP125  TEST-POINT3X4  [PAD.03X.04]  68.12,41.9 0 bottom
TP126  TEST-POINT3X4  [PAD.03X.04]  65.12,42.81 0 bottom
TP127  TEST-POINT3X4  [PAD.03X.04]  49.44,43.21 0 bottom
TP128  TEST-POINT3X4  [PAD.03X.04]  47.5,43.4 0 bottom
TP129  TEST-POINT3X4  [PAD.03X.04]  58.34,43.65 90 bottom
TP130  TEST-POINT3X4  [PAD.03X.04]  60.5,43.65 90 bottom
TP131  TEST-POINT3X4  [PAD.03X.04]  52.78,43.77 0 bottom
TP132  TEST-POINT3X4  [PAD.03X.04]  54.06,43.84 90 bottom
TP133  TEST-POINT3X4  [PAD.03X.04]  66,43.9 90 bottom
TP134  TEST-POINT3X4  [PAD.03X.04]  48.5,44.4 0 bottom
TP135  TEST-POINT3X4  [PAD.03X.04]  70.41,44.49 0 bottom
TP136  TEST-POINT3X4  [PAD.03X.04]  69.31,44.99 90 bottom
TP137  TEST-POINT3X4  [PAD.03X.04]  70.41,45.71 0 bottom
TP138  TEST-POINT3X4  [PAD.03X.04]  68.5,45.9 0 bottom
TP139  TEST-POINT3X4  [PAD.03X.04]  69.56,46.68 0 bottom
TP140  TEST-POINT3X4  [PAD.03X.04]  54,46.9 90 bottom
TP141  TEST-POINT3X4  [PAD.03X.04]  68.38,47.4 0 bottom
TP142  TEST-POINT3X4  [PAD.03X.04]  79.5,49.9 0 bottom
TP143  TEST-POINT3X4  [PAD.03X.04]  65.66,48.31 0 bottom
TP144  TEST-POINT3X4  [PAD.03X.04]  63.56,48.84 0 bottom
TP145  TEST-POINT3X4  [PAD.03X.04]  54.16,48.9 0 bottom
TP146  TEST-POINT3X4  [PAD.03X.04]  78.5,50.9 0 bottom
TP147  TEST-POINT3X4  [PAD.03X.04]  64.78,49.18 0 bottom
TP148  TEST-POINT3X4  [PAD.03X.04]  67.81,49.21 0 bottom
TP149  TEST-POINT3X4  [PAD.03X.04]  69,49.21 0 bottom
TP150  TEST-POINT3X4  [PAD.03X.04]  58,49.9 0 bottom
TP151  TEST-POINT3X4  [PAD.03X.04]  81.5,47.9 90 bottom
TP152  TEST-POINT3X4  [PAD.03X.04]  51.5,50.4 0 bottom
TP153  TEST-POINT3X4  [PAD.03X.04]  53,50.4 0 bottom
TP154  TEST-POINT3X4  [PAD.03X.04]  55,50.4 0 bottom
TP155  TEST-POINT3X4  [PAD.03X.04]  80.5,48.9 90 bottom
TP156  TEST-POINT3X4  [PAD.03X.04]  54,51.4 0 bottom
TP157  TEST-POINT3X4  [PAD.03X.04]  56,51.4 0 bottom
TP158  TEST-POINT3X4  [PAD.03X.04]  69.72,52.34 0 bottom
TP159  TEST-POINT3X4  [PAD.03X.04]  52,52.4 0 bottom
TP160  TEST-POINT3X4  [PAD.03X.04]  67.34,52.68 0 bottom
TP161  TEST-POINT3X4  [PAD.03X.04]  63,52.9 90 bottom
TP162  TEST-POINT3X4  [PAD.03X.04]  49.06,52.93 0 bottom
TP163  TEST-POINT3X4  [PAD.03X.04]  60.5,52.96 90 bottom
TP164  TEST-POINT3X4  [PAD.03X.04]  79,53.18 90 bottom
TP165  TEST-POINT3X4  [PAD.03X.04]  76.88,53.21 90 bottom
TP166  TEST-POINT3X4  [PAD.03X.04]  65.5,53.9 0 bottom
TP167  TEST-POINT3X4  [PAD.03X.04]  53.62,54.02 90 bottom
TP168  TEST-POINT3X4  [PAD.03X.04]  56.19,54.15 0 bottom
TP169  TEST-POINT3X4  [PAD.03X.04]  61.5,54.4 0 bottom
TP170  TEST-POINT3X4  [PAD.03X.04]  58,54.71 0 bottom
TP171  TEST-POINT3X4  [PAD.03X.04]  59.31,54.71 0 bottom
TP172  TEST-POINT3X4  [PAD.03X.04]  63,54.9 0 bottom
TP173  TEST-POINT3X4  [PAD.03X.04]  55,55.4 0 bottom
TP174  TEST-POINT3X4  [PAD.03X.04]  65.5,55.4 0 bottom
TP175  TEST-POINT3X4  [PAD.03X.04]  56.19,55.46 0 bottom
TP176  TEST-POINT3X4  [PAD.03X.04]  58,55.9 0 bottom
TP177  TEST-POINT3X4  [PAD.03X.04]  65,56.68 0 bottom
TP178  TEST-POINT3X4  [PAD.03X.04]  66.22,56.68 0 bottom
TP179  TEST-POINT3X4  [PAD.03X.04]  63.47,56.87 0 bottom
TP180  TEST-POINT3X4  [PAD.03X.04]  55,57.02 0 bottom
TP181  TEST-POINT3X4  [PAD.03X.04]  56.19,57.02 0 bottom
TP182  TEST-POINT3X4  [PAD.03X.04]  58.56,59.77 0 bottom
TP183  TEST-POINT3X4  [PAD.03X.04]  40,84.4 0 bottom
TP184  TEST-POINT3X4  [PAD.03X.04]  42,84.4 0 bottom
U1  RCLAMP0504FB  [SC70-6]  74.5,12.65 90 top
U2  TPS2051CDBVR  [DBV5]  82,14.4 90 top
U3  THGBMJG7C2LBAU8  [BGA-153(11.5X13)(EMMC-BA)]  59,19.9 0 top
U4  SN74LVC1G07DCK  [C70(TI-DCK)]  45,37.4 270 top
U5  SN74LVC8T245MPWREPPW24-M  [PW24-M]  12.5,42.9 270 top
U6  CLVCH16T245MDGGREP  [DGG48-M]  29.5,42.9 270 top
U7  OSD3358-512M-BSM  [OSD335X-BGA-256]  60.5,48.9 270 top
U8  TLV70028QDDCRQ1  [SOT23-5]  9.5,51.9 180 top
U9  TCA9509DGKRDGK8-M  [DGK8-M]  15.5,51.9 270 top
U10  TLVH431  [SOT23-3]  77.5,62.4 270 top
U11  TCAN330  [SOT23-8_TI-DCN]  12.5,62.9 180 top
U12  MIC842LYC5  [SC70-5]  19.5,68.9 180 top
U13  MIC842LYC5  [SC70-5]  19.5,72.9 180 top
U14  MAX4211FETE  [QFN65P400X400X80-17T210]  46,73.9 0 top
U15  TPS62112  [S-PVQFN-16]  59.46,74.12 270 top
U16  MAX7310ATE  [QFN65P400X400X80-17T210]  26.5,81.4 0 top
U17  25AAXX  [SOIC8]  81.5,53.4 180 top
U18  RCLAMP0504FB  [SC70-6]  71,64.49 270 top
U$1  FLIGHMARKERNEW  [FLIGHTMARKER_NEW_BOARDS]  10.1,30.6 0 top
U$2  [CAMERA_BOARD_TOP_DIMS]  10.25,21.1 0 top
U$3  [PSAS_LOGO_10X10]  87.5,84.4 0 top
Y1  24MHz  [5X3.2-4SMD]  75.91,42.56 90 top
Y2  ABS07-32.768KHZ-T  [CRYSTAL_3.2X1.5]  56.69,63.21 0 top

## Tracks (layer width: path | path; a pad name or v marks a point on that pad's centre or on a via)
2.8V  (via drill 0.25)
  Top 0.254: C25.1 U6.18 | U6.7 C26.1 | R18.1 19.9,54.8 19.1,54 v19.1,53.9
  Top 0.305: 32.25,45.34 U6.7 | U6.18 26.75,45.09
  Top 0.406: U5.1 16.62,45.77 17.15,46.3 C21.1 | 32.25,45.34 32,45.09 26.75,45.09 23.44,45.09 22.25,46.27 22.25,47.9 21.15,49 R17.1
  Top 0.508: U8.5 10.65,50.8 C23.1 12.85,50.8 13.12,50.52 13.12,48.4 13.62,47.9 16.19,47.9 16.48,48.18 | U9.8 16.48,48.18 | 16.48,48.18 16.48,48.15 v17.32,49 C24.1 | C24.1 R17.1 | C24.1 C21.1
  Bottom 0.254: v19.1,53.9 19.1,53.27 18.66,52.84 17.54,52.84 16.89,52.19 16.89,49.44 v17.32,49
3.3V  (via drill 0.25)
  Top 0.127: R1.1 53.5,11.4 53.12,11.78 C2.1
  Top 0.152: 55.75,21.15 56.25,20.65 55.75,20.15 | U3.P5 U3.N4 U3.P3
  Top 0.254: U3.C6 U3.E6 58.25,21.02 58.06,20.84 | 58.06,20.84 57.88,20.65 U3.F5 56.25,20.65 | 55.75,21.15 54.75,21.15 v54.75,19.46 54.75,20.15 55.75,20.15 | U3.K9 59.75,19.15 | U3.J10 59.75,19.15 | 59.75,19.15 58.06,20.84 | U3.M4 U3.N4 | U3.P3 v56.75,15.65 | U3.P5 v57.75,15.65 v56.75,15.65 | U6.42 32.25,36.9 C17.1 | U6.31 C16.1 | R9.10 47.39,35.48 v47.19,35.68 | R9.5 53.04,31.25 v53.03,31.24 | v54.69,36.06 55.38,36.06 R10.10 | R10.5 61,32.28 v61,30.96 | v54.81,15.65 v56.75,15.65 | R24.5 23.04,56.3 v23.06,56.27 | R29.1 45,60.77 45.38,60.4 v46,60.4 46.5,60.4 47,60.9 R30.1 | R22.2 v16,59.71
  Top 0.305: R20.2 R21.2 14,60.34 v14.88,61.21 | U8.3 8.5,53.15 v8.5,51.9 | v16,59.71 16,60.15 16.5,60.65 17.79,60.65 R24.10 | C40.2 81.31,49.4 81.5,49.59 v81.5,50.4 | v81.5,55.9 81.5,57.21 81.31,57.4 R60.1 | TP25.P$1 40.25,53.77 v40,53.52
  Top 0.406: v77.5,29.4 77.58,29.48 R8.5 | R8.10 83.54,27.42 v83.19,27.77 83.88,27.77 85,28.9 85,44.4 80.6,48.8 C40.2 79.56,49.4 79.14,49.83 U17.8 | U5.23 U5.24 17.18,40.03 17.71,39.5 C20.1 | C20.1 R12.2 v20.5,38.59 | v16.51,52.77 v16.5,52.78 16.5,54.1 U9.1 | C27.1 v12,52.02 | C20.1 v18.5,38.59 | C28.1 v18.5,55.9 | U11.3 12.18,65.47 11.75,65.9 C31.2 v10.5,65.9
  Top 0.508: v24.44,34.77 23.57,34.77 R11.2 | v27.75,36.65 C16.1 | v33.25,36.65 32.5,36.65 32.25,36.9 | v10.5,51.9 10.45,51.95 U8.1 10.65,53 C27.1
  Route15 0.406: v10.5,65.9 10.5,62.9
  Bottom 0.305: v81.5,50.4 v81.5,55.9
  Bottom 0.406: v76.31,20.15 76.31,23.21 77.5,24.4 v77.5,29.4 80,29.4 81.62,27.77 v83.19,27.77 | J102.1 14.04,53.31 12.75,52.02 v12,52.02
  other vias: 52.88,13.46 52.81,16.9 52.81,18.4 52.81,19.9 52.81,21.4 54,17.84 57.38,51.46 57.94,52.09 57.94,50.77 52.84,15.56 52.84,14.56 75.72,20.15 35.5,53.52 36.25,53.52 37,53.52 37.75,53.52 38.5,53.52 39.25,53.52 36,51.09 35.31,51.09
  pour Top (isolate 0.2, no thermals): 51.31,22.02 53.38,22.02 54.12,21.27 55.25,21.27 55.25,10.9 51.31,10.9
  pour Top: 57,52.21 57,50.65 57.19,50.46 58.75,50.46 58.94,50.65 58.94,52.21 58.75,52.4 57.19,52.4
  pour Route15 (isolate 0.2): 59,52.4 59,47.9 57,47.9 54.97,45.87 54.97,32.87 53,30.9 49,30.9 48,31.9 48,58.4 49,59.4 52,59.4
  pour Bottom (no thermals): 75.47,21.93 75.47,20.46 75.38,20.37 75.38,19.99 75.5,19.87 76.53,19.87 76.66,19.99 76.66,20.34 76.53,20.46 76.53,21.93
  pour Top (no thermals): 75.22,21.81 75.56,18.21 76.66,18.21 76.66,21.81
  pour Route15 (isolate 0.2, no thermals): 54,57.4 47.5,63.9 10,63.9 8,61.9 8,31.9 10,29.9 52,29.9 54,31.9
  pour Route15 (isolate 0.2, rank 5): 43,37.9 53,37.9 59.5,31.4 72.5,31.4 78.5,25.4 78.5,16.4 77.5,15.4 66,15.4 61.5,10.9 50.5,10.9 50,11.4 50,22.9 43,29.9
  pour Top (no thermals): 34.5,54.4 41,54.4 41,51.4 36.5,51.4 36.5,50.52 34.5,50.52
  pour Bottom (rank 2, no thermals): 35,54.4 40.5,54.4 40.5,52.9 37.5,52.9 37.5,51.96 36.25,50.71 35,50.71
3.3VA  (via drill 0.25)
  Top 0.254: 43.06,36.75 43,36.75 | 42,36.75 C18.1 40,36.5 TP14.P$1
  Top 0.305: v64.4,51.18 64.42,51.17 64.42,47.74 U7.K11 | v64.31,45.65 63.75,45.65 U7.L11 | U4.5 43.06,36.75 43.06,43.34 v43,43.4 | 42,36.75 43,36.75 | v75,56.4 73.5,56.4 72.22,57.68 72.22,61.65 72.97,62.4 72.97,64.49 | 72.97,64.49 U18.5 | 72.97,64.49 72.97,64.65 73.32,65 C41.1
  Bottom 0.305: v64.31,45.65 63.94,45.65 63.69,45.4 59.88,45.4 59.69,45.21 56.94,45.21 56.55,45.6 45.2,45.6 v43,43.4 | v64.4,51.18 64.48,51.1 70.96,51.1 71.02,51.17 77.27,51.17 79,52.9 TP164.P$1 JP104.1 78.13,54.89 77.94,55.09 77.94,56.74 77.53,57.15 75.75,57.15 v75,56.4
  pour Top: 63.81,47.27 63.53,47.27 63.38,47.12 63.38,45.59 63.53,45.43 63.81,45.43 63.97,45.59 63.97,47.12
5V  (via drill 0.25, 0.35)
  Top 0.254: U15.10 59.14,71.11 v59.16,71.09
  Top 0.3: R62.2 70.5,76.9 67.72,74.12 L1.2
  Bottom 0.254: v59.16,71.09 59.78,71.71 64.69,71.71 TP49.1
  other vias: 62.25,40.02 62.94,40.02 62.25,41.27 62.94,41.56 62.94,40.96 72,68.9 71,67.9 72,66.9 70,66.9 70,68.9 69,67.9 68,68.9 68,66.9 67,67.9 66,68.9 66,66.9 65,67.9
  pour Top (isolate 0.2, no thermals): 64.5,79.09 69.31,79.09 73,75.4 73,66.21 64.5,66.21
  pour Top (isolate 0.2, no thermals): 62.94,42.21 62.12,42.21 61.97,42.06 61.97,38.68 64.25,36.4 65.47,36.4 66.62,35.24 66.62,32.49 69.34,32.49 69.34,35.15 66.59,37.9 64.5,37.9 63.31,39.09 63.31,41.84
  pour Route15 (isolate 0.2): 59.28,39.49 67.5,39.49 67.5,67.9 57,67.86 57,54.82 59.28,52.56
  pour Route15 (isolate 0.2, no thermals): 72.5,69.4 57,69.4 57,59.84 70.44,59.84 73,62.4 73,68.9
!FAULT
  Top 0.254: Q2.3 38.89,68.76 38.6,68.47 R32.1 38.54,67.4 35.5,67.4 TP45.1 32.5,69.4 32.5,73.84 31.44,74.9 30.12,74.9 26.82,78.2 U16.7
!OE_E  (via drill 0.25)
  Top 0.127: v12.12,43.9 12.18,43.95 U5.7
  Bottom 0.127: J101.26 33.25,49.63 26.78,43.16 12.86,43.16 v12.12,43.9
!RESET_E  (via drill 0.25)
  Top 0.127: v13.5,43.9 13.47,43.92 U5.5
  Bottom 0.127: J101.24 32.25,49.35 26.57,43.67 13.73,43.67 v13.5,43.9
!SD
  Top 0.813: J4.40 J4.39
  Bottom 0.813: J4.40 J4.39
AD0  (via drill 0.35)
  Top 0.254: R70.1 R69.2 R57.1 R58.2 R70.1 | v20.5,83.9 22.31,83.9 23.84,82.38 U16.1 | v19.09,83.12 R70.1
  Bottom 0.254: v20.5,83.9 19.72,83.12 v19.09,83.12
AD1  (via drill 0.35)
  Top 0.254: U16.2 23.58,81.72 22.19,83.12 v20.53,83.12 | R55.1 R67.2 R68.1 v14.38,82.21 R56.2 R55.1
  Bottom 0.254: v20.53,83.12 19.62,82.21 v14.38,82.21
AD2  (via drill 0.35)
  Top 0.254: 8.94,82.21 R53.1 R54.2 R66.1 R65.2 8.94,82.21 | U16.3 23.36,81.08 22.07,82.37 20.56,82.37 v20.53,82.34 | v9.84,82.21 8.94,82.21
  Bottom 0.254: v20.53,82.34 19.49,81.3 R54.2 v9.84,82.21
BOOT0  (via drill 0.35)
  Top 0.254: U16.10 29.14,81.08 v29.62,80.59
  Bottom 0.254: TP51.1 29.62,77.28 v29.62,80.59
BUS_OE  (via drill 0.25)
  Top 0.127: R11.1 23.75,36.89 U6.25 23.75,40.52 v23.69,40.59 | U6.48 35.25,40.27 35.41,40.42 35.84,40.42 v36,40.26 | U7.F14 67,51.59 67,49.65 66.44,49.09 65.88,49.09 65.39,48.6 65.39,44.28 64.92,43.81 v64.31,43.81
  Bottom 0.127: v23.69,40.59 23.97,40.59 24.09,40.47 24.53,40.47 TP113.P$1 25.47,40.47 35.79,40.47 v36,40.26 36.21,40.47 55.59,40.47 56.44,39.62 58.3,39.62 59.46,40.78 61.41,40.78 61.73,41.1 61.73,41.73 63.81,43.81 v64.31,43.81
CAM_OE  (via drill 0.25)
  Top 0.127: U7.F15 69.4,52.08 69.84,51.63 71.13,51.63 72.04,50.72 v72.04,49.32 | v45,35.15 45,33.64 44.25,32.89 43.43,32.89 43.31,33.01 15.89,33.01 TP8.P$1 11.53,37.38 U5.17
  Bottom 0.127: v72.04,49.32 72.04,49.11 73.36,47.79 73.36,34.78 72.26,33.68 48.03,33.68 46.56,35.15 v45,35.15
CAN1_H
  Top 0.813: J4.34 J4.33
  Bottom 0.254: TP184.P$1 41.65,84.75 J4.34
  Bottom 0.813: J4.34 J4.33
CAN1_L
  Top 0.813: J4.36 J4.35
  Bottom 0.254: TP183.P$1 40.38,84.78 J4.36
  Bottom 0.813: J4.36 J4.35
CAN2_H  (via drill 0.25)
  Top 0.254: U11.7 12.82,60.66 12.12,59.96 9.5,59.96 6.81,62.65 v6.81,75.4
  Top 0.61: J4.18 J4.17
  Bottom 0.254: J4.17 51.8,90.5 50.69,91.62 12.72,91.62 6.78,85.68 6.78,75.43 v6.81,75.4
  Bottom 0.61: J4.18 J4.17
CAN2_L  (via drill 0.25)
  Top 0.254: U11.6 12.18,60.7 11.94,60.46 9.75,60.46 7.5,62.71 v7.5,75.4
  Top 0.61: J4.20 J4.19
  Bottom 0.254: J4.19 50.53,90.36 50,90.9 13,90.9 7.5,85.4 v7.5,75.4
  Bottom 0.61: J4.20 J4.19
CB-RESET  (via drill 0.35)
  Top 0.254: R39.2 49,69.4 47.86,70.54 v47.86,72.21 U14.9 | U16.9 28.36,78.7 29.06,77.99 34.09,77.99 TP54.1
  Bottom 0.254: v47.86,72.21 47.17,72.9 41,72.9 TP54.1
CB_CTRL  (via drill 0.35)
  Top 0.254: U14.6 45.67,71.04 v45.69,71.03 | 44.14,71.04 v44.16,71.03 | v51.28,81.34 52.29,81.34 Q5.3 52.3,82.04 51.9,82.44 R64.1 | 44.14,71.04 Q2.1 40.42,71.67 40.09,71.99 37.84,71.99 37,72.84 37,73.9 TP52.1 | 44.14,71.04 44.14,71.05 U14.4 U14.3
  Bottom 0.254: v44.16,71.03 44.78,70.4 45.69,70.4 | v51.28,81.34 51.28,78.06 52.62,76.71 52.62,73.53 49.5,70.4 45.69,70.4 | v45.69,71.03 45.69,70.4
CLK_EN  (via drill 0.25)
  Top 0.127: U7.E16 70.86,53.34 73.76,50.44 v73.76,49.32 | v44.03,34.16 43.56,34.16 43.17,33.77 19.58,33.77 18.5,34.85 TP11.P$1 16.5,36.9 15.5,36.9 13.47,38.92 U5.20
  Bottom 0.127: v73.76,49.32 73.76,49.17 74.38,48.55 74.38,34.36 72.68,32.66 46.59,32.66 45.09,34.16 v44.03,34.16
CLK_EN_E  (via drill 0.25)
  Top 0.127: v14.12,44.21 U5.4
  Bottom 0.127: J101.23 31.75,49.2 26.47,43.92 14.41,43.92 v14.12,44.21
D0_E  (via drill 0.25)
  Top 0.127: U6.11 30.25,50.56 26.26,54.55 v26.26,55.21
  Bottom 0.127: J101.12 v26.25,55.21 v26.26,55.21
D0_I  (via drill 0.25)
  Top 0.127: U6.38 30.25,40.65 31.55,41.95 36.42,41.95 37.84,43.37 TP19.P$1 38.36,43.92 38.38,43.92 39.24,44.77 39.77,44.77 48.5,53.51 48.5,55.38 48.87,55.75 48.87,56.25 50.2,57.59 v50.5,57.59
  Bottom 0.127: JP102.1 67.5,56.42 66.17,57.74 50.66,57.74 v50.5,57.59
D1_E  (via drill 0.25)
  Top 0.127: U6.12 29.75,48.37 28.53,49.59 28.53,51.92 27.61,52.84 25.76,54.69 v25.76,54.86
  Bottom 0.127: J101.11 v25.75,54.86 v25.76,54.86
D1_I  (via drill 0.25)
  Top 0.127: U6.37 29.75,40.65 31.3,42.2 35.65,42.2 37.92,44.48 TP21.P$1 38.56,45.09 39.72,45.09 48.24,53.61 48.24,55.49 48.61,55.86 48.61,56.36 50.16,57.9 v50.16,58.08
  Bottom 0.127: JP103.1 70.81,56.87 70.64,57.05 67.23,57.05 66.28,58 50.68,58 50.67,58.01 50.23,58.01 v50.16,58.08
D2_E  (via drill 0.25)
  Top 0.127: U6.13 29.25,48.51 28.27,49.49 28.27,51.82 27.5,52.59 27.41,52.59 25.26,54.74 v25.26,55.21
  Bottom 0.127: J101.10 v25.25,55.21 v25.26,55.21
D2_I  (via drill 0.25)
  Top 0.127: U6.36 29.25,40.65 31.05,42.45 34.85,42.45 37.8,45.4 39.67,45.4 47.45,53.18 TP24.P$1 47.52,56.38 49.13,57.98 v49.56,57.98
  Bottom 0.127: JP110.1 66.9,59.92 65.59,58.61 50.09,58.61 49.74,58.25 49.74,58.16 v49.56,57.98
D3_E  (via drill 0.25)
  Top 0.127: U6.14 28.75,48.65 28.02,49.38 28.02,51.71 27.4,52.33 27.25,52.33 v24.73,54.86
  Bottom 0.127: J101.9 24.75,54.84 v24.73,54.86
D3_I  (via drill 0.25)
  Top 0.127: U6.35 28.75,40.65 30.81,42.71 34.75,42.71 37.69,45.65 39.57,45.65 46.25,52.34 TP23.P$1 46.51,56.39 48.74,58.63 v49.5,58.63
  Bottom 0.127: JP111.1 70.81,60.27 70.62,60.46 67.09,60.46 65.5,58.87 49.76,58.87 49.52,58.63 v49.5,58.63
D4_E  (via drill 0.25)
  Top 0.127: U6.16 27.75,48.34 27.76,48.35 27.76,51.61 27.29,52.08 26.9,52.08 24.23,54.75 v24.23,55.21
  Bottom 0.127: J101.8 24.25,55.19 v24.23,55.21
D4_I
  Top 0.127: U6.33 27.75,40.65 30.06,42.96 34.64,42.96 37.59,45.91 39.46,45.91 45.5,51.95 45.5,56.43 TP27.P$1 46.49,57.41 48.15,59.06 50.34,59.06 U7.A1
D5_E  (via drill 0.25)
  Top 0.127: U6.17 27.25,48.2 27.51,48.46 27.51,51.5 27.19,51.83 26.73,51.83 23.74,54.82 v23.74,54.88
  Bottom 0.127: J101.7 23.75,54.87 v23.74,54.88
D5_I
  Top 0.127: U6.32 27.25,40.65 29.82,43.22 34.54,43.22 37.48,46.16 39.31,46.16 45.23,52.08 TP26.P$1 47.38,59.31 50.71,59.31 51.6,58.42 U7.A2
D6_E  (via drill 0.25)
  Top 0.127: U6.19 26.25,48.13 26,48.38 26,51.97 23.23,54.75 v23.23,55.21
  Bottom 0.127: J101.6 23.23,52.42 v23.23,55.21
D6_I
  Top 0.127: U6.30 26.25,40.65 29.07,43.47 34.43,43.47 37.38,46.42 39.21,46.42 44.54,51.74 44.54,57.49 45.32,58.27 | U7.B2 52.81,57.72 53.44,57.72 53.96,58.24 53.96,58.61 53.7,58.87 51.52,58.87 50.82,59.57 46.62,59.57 45.23,58.17 45.32,58.27 | TP29.P$1 45.32,58.27
D7_E  (via drill 0.25)
  Top 0.127: U6.9 31.25,49.92 26.76,54.41 v26.76,54.86
  Bottom 0.127: J101.13 v26.75,54.86 v26.76,54.86
D7_I
  Top 0.127: U6.40 31.25,40.65 32.29,41.69 37.14,41.69 38.92,43.48 TP20.P$1 39.84,44.37 39.84,44.49 48.75,53.4 48.75,55.28 49.12,55.65 49.12,56.15 50.13,57.16 U7.B1
D8_E  (via drill 0.25)
  Top 0.127: U6.8 31.75,47.95 31.5,48.19 31.5,50.02 27.23,54.3 v27.23,55.21
  Bottom 0.127: J101.14 27.25,55.19 v27.23,55.21
D8_I
  Top 0.127: U6.41 31.75,40.65 32.54,41.44 37.91,41.44 38.84,42.37 TP17.P$1 38.89,42.4 40.35,43.86 40.35,44.64 49.01,53.3 49.01,55.17 49.38,55.54 49.38,56.04 49.91,56.58 51.05,56.58 52.45,57.98 53.07,57.98 U7.A3
D9_E  (via drill 0.25)
  Top 0.127: U6.6 32.75,47.96 33,48.21 33,51.46 32.75,51.71 30.17,51.71 27.76,54.13 v27.76,54.8
  Bottom 0.127: J101.15 v27.75,54.79 v27.76,54.8
D9_I
  Top 0.127: U6.43 32.75,40.65 33.28,41.19 38.63,41.19 39.92,42.48 TP18.P$1 40.6,43.12 40.6,44.53 49.26,53.19 49.26,55.02 49.69,55.45 49.69,55.99 50.02,56.33 52.69,56.33 U7.B3
D10_E  (via drill 0.25)
  Top 0.127: U6.5 33.25,48.1 33.25,48.11 33.25,51.66 32.95,51.97 30.28,51.97 28.26,53.99 v28.26,55.21
  Bottom 0.127: J101.16 v28.25,55.21 v28.26,55.21
D10_I
  Top 0.127: 39.94,41.46 39.41,40.93 33.56,40.93 33.25,40.62 U6.44 | U7.C3 53,55.37 49.97,55.37 49.51,54.91 49.51,53.09 40.93,44.51 40.93,42.46 39.94,41.46 | TP15.P$1 39.94,41.46
D11_E  (via drill 0.25)
  Top 0.127: v28.76,54.83 28.76,53.85 30.38,52.22 33.05,52.22 33.51,51.77 33.51,48.95 34.25,48.21 U6.3
  Bottom 0.127: J101.17 v28.75,54.83 v28.76,54.83
D11_I
  Top 0.127: U7.C4 54.66,55.88 53.89,55.12 50.08,55.12 49.77,54.81 49.77,52.98 41.19,44.4 41.19,42.35 41.09,42.26 TP16.P$1 40.15,40.68 34.5,40.68 34.25,40.43 U6.46
EEPROM_WP  (via drill 0.25)
  Top 0.127: R75.1 64.22,65.81 64.47,66.06 71.5,66.06 71.92,65.63 U18.6 71.4,65.14 71.16,64.9 71.16,62.43 v71.66,61.93 | v67.03,9.24 67.84,9.24 68,9.09 J1.20
  Bottom 0.127: v71.66,61.93 71.86,61.73 76.26,61.73 81.02,56.98 81.02,50.01 82.5,48.52 TP112.P$1 79.52,43.92 79.52,39.82 85.4,33.93 85.4,16.24 79.2,10.04 73.09,10.04 72.44,9.38 67.17,9.38 v67.03,9.24
FLASH  (via drill 0.25)
  Top 0.127: U7.G15 68.75,51.09 69.04,51.38 70.91,51.38 71.62,50.66 v71.62,48.79 | U6.47 34.75,37.65 37,35.4 TP13.P$1 v44,35.4
  Bottom 0.127: v71.62,48.79 71.86,48.79 73.11,47.54 73.11,34.88 72.16,33.93 48.25,33.93 46.61,35.57 44.83,35.57 44.66,35.4 v44,35.4
FLASH_E  (via drill 0.25)
  Top 0.127: U6.2 34.75,48.13 33.76,49.12 33.76,52.84 33.12,53.48 v33.12,53.59
  Bottom 0.127: J101.28 34.25,53.15 33.81,53.59 v33.12,53.59
GND  (via drill 0.25, 0.35)
  Top 0.152: U3.N5 U3.P6
  Top 0.254: v57.25,21.15 U3.C4 | U3.H10 60,19.65 v59.75,19.9 v59,20.65 58.75,20.9 U3.E7 | U3.G5 58,20.15 v58.25,19.9 v59,19.15 59.25,18.9 U3.K8 | U3.P6 v58.25,16.15 | U3.N2 v56.25,16.15 | v46.44,71.03 46.33,71.14 U14.7 46.33,73.58 U14.EPAD | J1.6 v75,7.4 | J1.3 v76.5,7.4 | J1.9 v73.5,7.4
  Top 0.3: U15.16 60.44,75.1 | U15.1 60.44,75.1 | 60.44,75.1 U15.PAD | U15.6 59.14,74.45 U15.PAD | U15.7 59.14,73.8 U15.PAD | U15.9 58.49,73.15 U15.PAD | U15.11 59.79,73.8 U15.PAD | U15.12 60.44,73.15 U15.PAD
  Top 0.406: U11.2 12.82,65.41 13.31,65.9 C31.1
  Bottom 0.127: J100.CGND3 82.03,5.78 J100.CGND1
  Bottom 0.254: v21.38,51.46 21.38,51.52 21.25,51.65 J101.2 21.25,53.82 v21.33,53.9 | v22.03,50.84 21.25,50.84 20.75,51.34 J101.1 20.75,53.75 v20.6,53.9 | J101.19 v29.75,53.75 | J101.18 29.22,52.43 v29.22,54.03 | J101.20 v30.25,54.03
  other vias: 73,29.4 72,29.4 71,29.4 70,29.4 69,29.4 68,29.4 67,29.4 66,29.4 65,29.4 64,29.4 97.5,11.4 1,31.4 1,36.4 1,41.4 1,46.4 1,51.4 1,56.4 1,61.4 1,66.4 1,71.4 1,76.4 1,81.4 1,86.4 6.5,91.4 97.5,16.4 97.5,21.4 97.5,26.4 97.5,31.4 97.5,36.4 97.5,41.4 97.5,46.4 97.5,51.4 97.5,56.4 97.5,61.4 97.5,66.4 97.5,71.4 97.5,76.4 97.5,81.4 97.5,86.4 90,70.9 92.5,91.5 60.46,71.03 59.86,71.03 57.56,72.03 58.46,71.03 59.46,74.12 60.26,74.92 60.26,73.33 58.66,73.33 58.66,74.92 61.16,76.62 62.78,75.58 64.06,77.8 63.2,80.62 62.26,72.53 64.06,76.12 95,91.9 31.26,50.96 33.75,48.02 30.79,48.96 28.26,48.15 25.25,48.02 25.25,37.77 28.25,37.77 30.75,37.77 33.75,37.77 57.25,16.15 29.55,49.49 26.75,50.05 40.81,30.34 25.19,30.34 10.56,30.34 7.12,49.4 50.88,13.68 50.88,15.53 50.88,17.34 50.72,20.15 49.06,22.9 56.69,53.34 59.25,53.34 61.78,53.34 60.5,53.96 64.31,52.81 65.59,52.77 64.94,50.15 64.94,47.65 64.94,45.09 64.31,44.96 61.75,44.87 59.25,43.74 56.72,43.96 56.06,45.09 56.06,47.65 56.06,50.15 56.06,52.71 75.91,40.77 77,43.15 76,36.9 75.59,49.15 66.41,50.12 66.84,48.24 47,37.99 41.97,37.43 55.38,48.9 75.31,55.34 82.47,21.31 75.47,15.46 63.88,6.43 65.56,4.68 78.41,4.68 71.56,40.77 59.75,34.4 45.16,36.02 73.81,20.15 72.44,19.9 60.84,29.02 56.62,30.87 67,24.4 61.5,14.9 64,11.9 60.97,23.71 42.31,71.9 44.09,67.4 51.91,70.4 51.91,78.4 46,73.9 74.53,81.18 56.94,70.43 62.25,79.81 19.06,72.93 19.5,68.99 31.34,67.9 20.88,74.71 21.5,65.87 26.5,81.4 18,78.53 14.38,78.53 10.72,78.53 9.88,76.84 29,83.9 29,85.9 41.81,42.52 77.5,37.9 86,91.9 78,91.9 70,91.9 62,91.9 30.09,92.74 22,92.71 14.06,92.84 14.09,88.99 20.03,88.93 13.25,75.4 42.9,76.6 48.12,78.21 54,83.9 57.75,82.71 65.03,80.43 65.5,83.4 76,74.4 59.91,66.68 41.63,64.51 35.21,65.43 16.56,65.46 36.94,84.74 26.19,78.53 45,1.4 49.5,1.4 54,1.4 58.5,1.4 63,1.4 67.5,1.4 72,1.4 76.5,1.4 81,1.4 85.5,5.9 90,5.9 95.38,9.21 45,3.4 49.75,10.18 45,23.9 45,26.9 5,29.4 35,35.4 72,87.4 31.5,89.9 35.5,87.46 57.25,19.15 76.19,12.65 24.5,60.65 32.94,59.4 39.25,56.34 82.88,19.09 71.75,16.15 17.48,49.9 18.1,53.9 13,53.4 8,55.4 12,47.9 18.5,45.4 20.5,45.4 9.53,48.46 9.56,47.46 9.56,43.65 8.94,44.21 8.94,41.65 8.94,38.46 18.5,40.4 14.5,52.77 9.5,51.9 74.81,28.21 49,60.9 43.5,60.9 51,63.9 61.28,60.9 76.12,65.4 75.5,68.9 75,77.9 84,71.9 81.5,66.4 84,60.9 84,47.9 84,37.4 84,41.9 86,29.9 86,23.9 86,17.9 84,11.9 80,77.9 38,37.9 47,44.4 23.29,49.27 19.6,47.65 11,69.9 15,65.9 57.91,13.4 51.5,2.9 58,2.9 73,5.9 76,5.9 79,16.4 77,16.4 74,22.52 80.12,21.4 75.75,48.4 56.75,48.9 50.88,19.15 31.5,57.27 37.19,59.09 68.88,22.65 85.56,55.34 84,56.4 83.56,49.4 80.5,60.65 27.81,34.71 33.31,34.77 19.5,36.9 7,40.4 5,23.4 1.5,10.4 1,26.9 74,67.81 69.22,64.49 38.31,51.02 37.19,51.02 41.62,52.02 41.62,51.34 37.75,50.77 39.81,48.21 38.88,48.21 38.06,48.21 37.12,48.21 36.31,48.21 35.5,48.21 41.62,50.65 43.5,76.6 44.1,76.6 44.7,78.4
  pour Route15 (isolate 0.2, rank 6): -1.5,-1.5 102.5,-1.5 102.5,96.2 -1.5,96.2
  pour Top (isolate 0.2, rank 6): -0.5,-0.5 101.5,-0.5 101.5,95.2 -0.5,95.2
  pour Bottom (isolate 0.2, rank 6): 0,0 101,0 101,94.9 0,94.9
  pour Route2 (isolate 0.2, rank 6): -1,-1 102,-1 102,95.7 -1,95.7
  pour Top: 81,87.9 81,81.4 84,78.4 90.5,78.4 93.5,81.4 93.5,87.9 91,90.4 83.5,90.4
  pour Bottom (no thermals): 37.12,52.96 37.12,51.34 37,51.21 37,50.65 37.56,50.09 41.06,50.09 41.06,52.96
HSYNC_E  (via drill 0.25)
  Top 0.127: U6.22 24.75,52.23 22.23,54.75 v22.23,55.21
  Bottom 0.127: J101.4 22.23,52.42 v22.23,55.21
HSYNC_I  (via drill 0.25)
  Top 0.127: U6.27 24.75,41.09 v24.81,41.15 | v57.94,41.9 U7.P7
  Top 0.15: U7.P7
  Bottom 0.127: v24.81,41.15 25.57,41.91 27.02,41.91 TP119.P$1 27.77,41.16 57.2,41.16 v57.94,41.9
I2C0_SCL  (via drill 0.25)
  Top 0.127: J1.18 69,9.4 67.81,10.59 v67.06,10.59 | R73.1 66.03,64.59 66.22,64.4 68.5,64.4 69.06,63.84 U18.3 70.08,63.48 68.5,61.9 v68.5,61.4
  Bottom 0.127: v68.5,61.4 69,61.4 69.17,61.22 76.05,61.22 80.51,56.77 TP155.P$1 79.01,47.41 79.01,39.61 84.9,33.72 84.9,16.45 78.99,10.55 72.88,10.55 72.32,9.98 67.85,9.98 67.25,10.59 v67.06,10.59
I2C0_SDA  (via drill 0.25)